# EAGLE design module_special_reg (EAGLE 6.5.0)

## Sheet 1 of 9
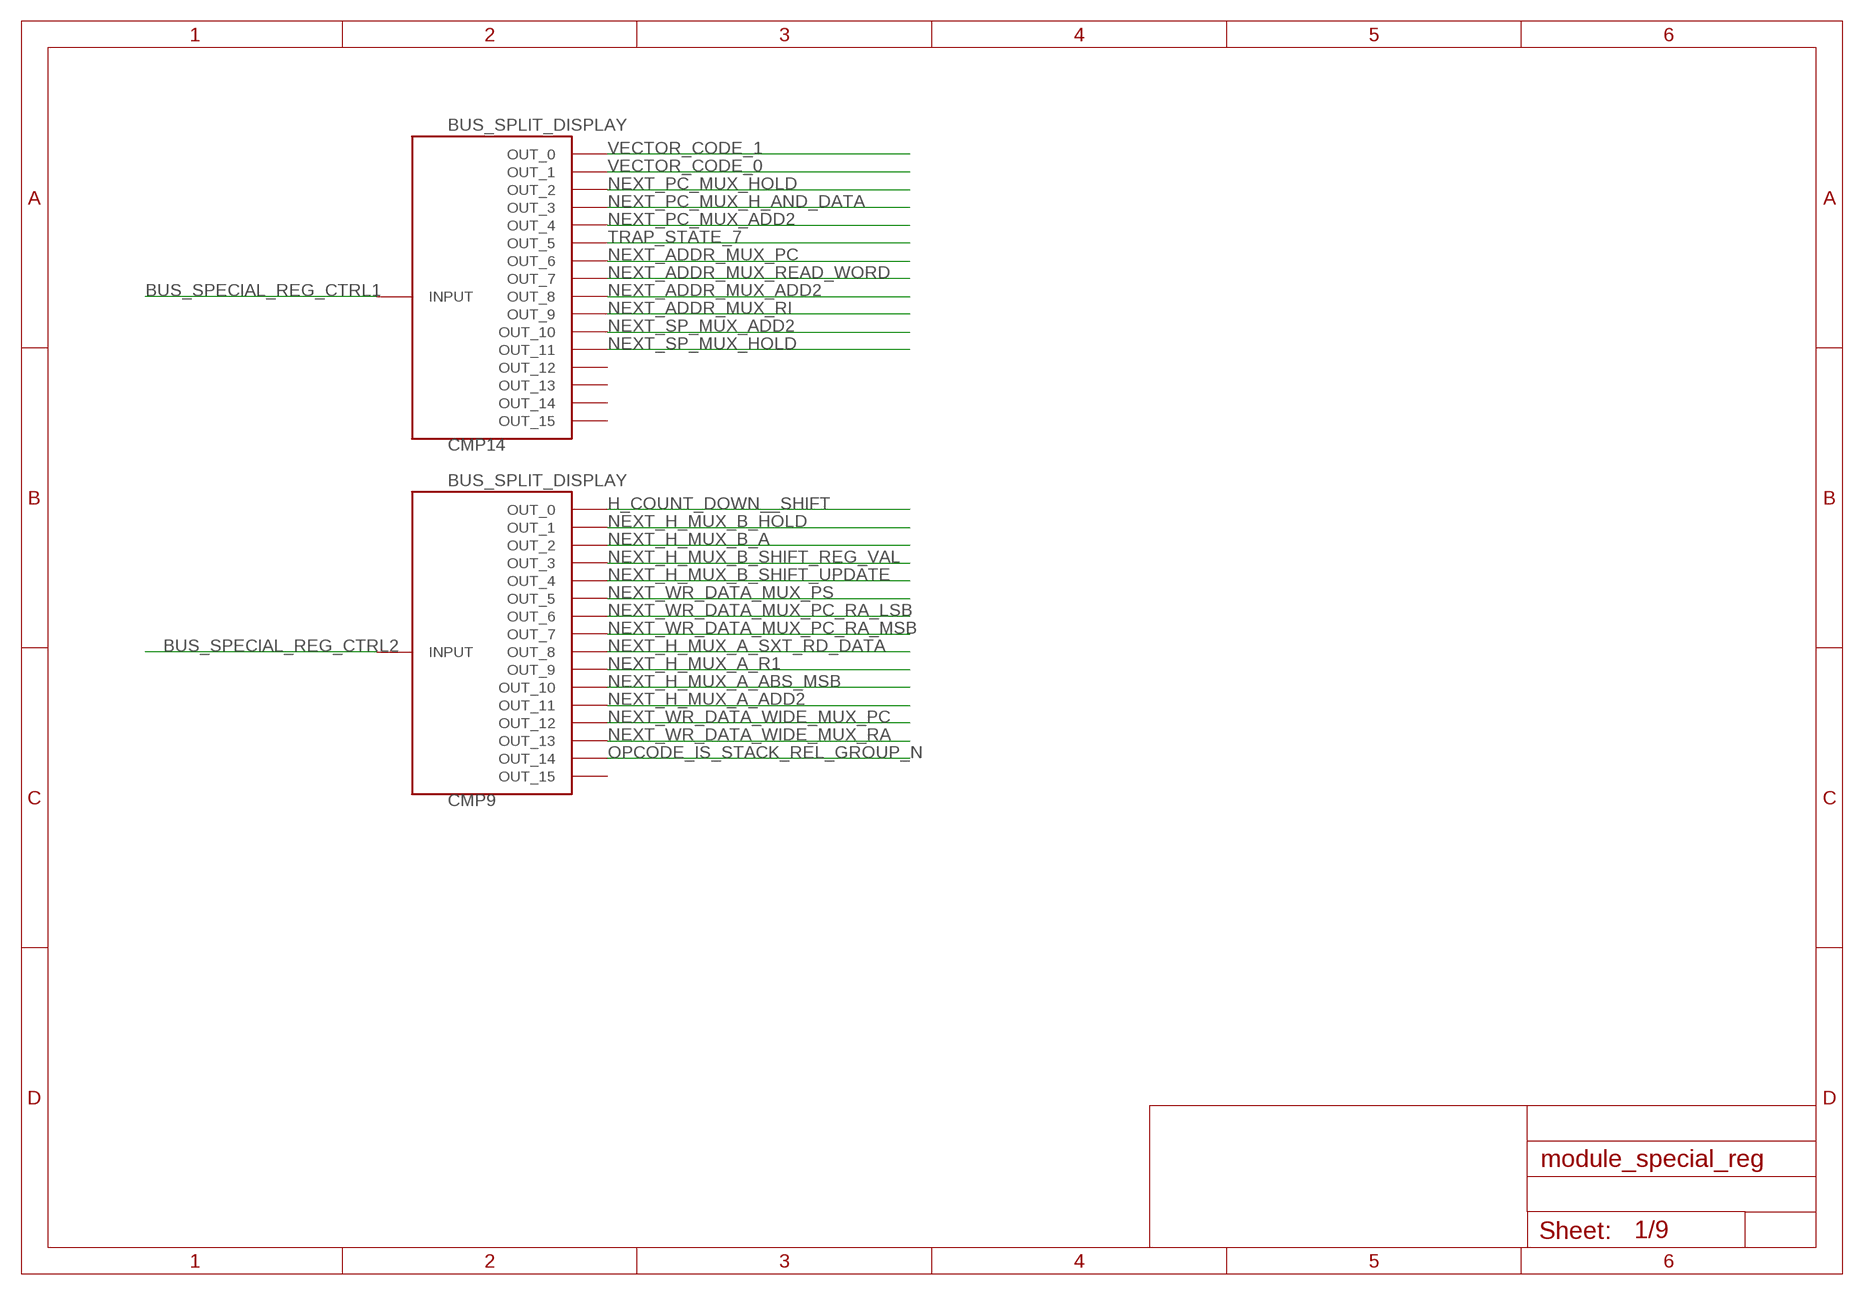
[diagram p0: schematic, sheet 1]

### Parts
CMP9  BUS_SPLIT_DISPLAY  [BUS_SPLIT_DISPLAY]
CMP14  BUS_SPLIT_DISPLAY  [BUS_SPLIT_DISPLAY]

### Nets
BUS_SPECIAL_REG_CTRL1: CMP14.INPUT
BUS_SPECIAL_REG_CTRL2: CMP9.INPUT
H_COUNT_DOWN__SHIFT: CMP9.P$1(OUT_0) ; also sheet 5
NEXT_ADDR_MUX_ADD2: CMP14.P$9(OUT_8) ; also sheet 9
NEXT_ADDR_MUX_PC: CMP14.P$7(OUT_6) ; also sheet 9
NEXT_ADDR_MUX_READ_WORD: CMP14.P$8(OUT_7) ; also sheet 9
NEXT_ADDR_MUX_RI: CMP14.P$10(OUT_9) ; also sheet 9
NEXT_H_MUX_A_ABS_MSB: CMP9.P$11(OUT_10) ; also sheet 4
NEXT_H_MUX_A_ADD2: CMP9.P$12(OUT_11) ; also sheet 4
NEXT_H_MUX_A_R1: CMP9.P$10(OUT_9) ; also sheet 4
NEXT_H_MUX_A_SXT_RD_DATA: CMP9.P$9(OUT_8) ; also sheet 4
NEXT_H_MUX_B_A: CMP9.P$3(OUT_2) ; also sheet 4
NEXT_H_MUX_B_HOLD: CMP9.P$2(OUT_1) ; also sheet 4
NEXT_H_MUX_B_SHIFT_REG_VAL: CMP9.P$4(OUT_3) ; also sheet 4
NEXT_H_MUX_B_SHIFT_UPDATE: CMP9.P$5(OUT_4) ; also sheet 4
NEXT_PC_MUX_ADD2: CMP14.P$5(OUT_4) ; also sheet 8
NEXT_PC_MUX_H_AND_DATA: CMP14.P$4(OUT_3) ; also sheet 8
NEXT_PC_MUX_HOLD: CMP14.P$3(OUT_2) ; also sheet 8
NEXT_SP_MUX_ADD2: CMP14.P$11(OUT_10) ; also sheet 9
NEXT_SP_MUX_HOLD: CMP14.P$12(OUT_11) ; also sheet 9
NEXT_WR_DATA_MUX_PC_RA_LSB: CMP9.P$7(OUT_6) ; also sheet 7
NEXT_WR_DATA_MUX_PC_RA_MSB: CMP9.P$8(OUT_7) ; also sheet 7
NEXT_WR_DATA_MUX_PS: CMP9.P$6(OUT_5) ; also sheet 7
NEXT_WR_DATA_WIDE_MUX_PC: CMP9.P$13(OUT_12) ; also sheet 7
NEXT_WR_DATA_WIDE_MUX_RA: CMP9.P$14(OUT_13) ; also sheet 7
OPCODE_IS_STACK_REL_GROUP_N: CMP9.P$15(OUT_14) ; also sheet 6
TRAP_STATE_7: CMP14.P$6(OUT_5) ; also sheet 8
VECTOR_CODE_0: CMP14.P$2(OUT_1) ; also sheet 8
VECTOR_CODE_1: CMP14.P$1(OUT_0) ; also sheet 8
Unconnected: CMP9.P$16(OUT_15) CMP14.P$13(OUT_12) CMP14.P$14(OUT_13) CMP14.P$15(OUT_14) CMP14.P$16(OUT_15)

## Sheet 2 of 9
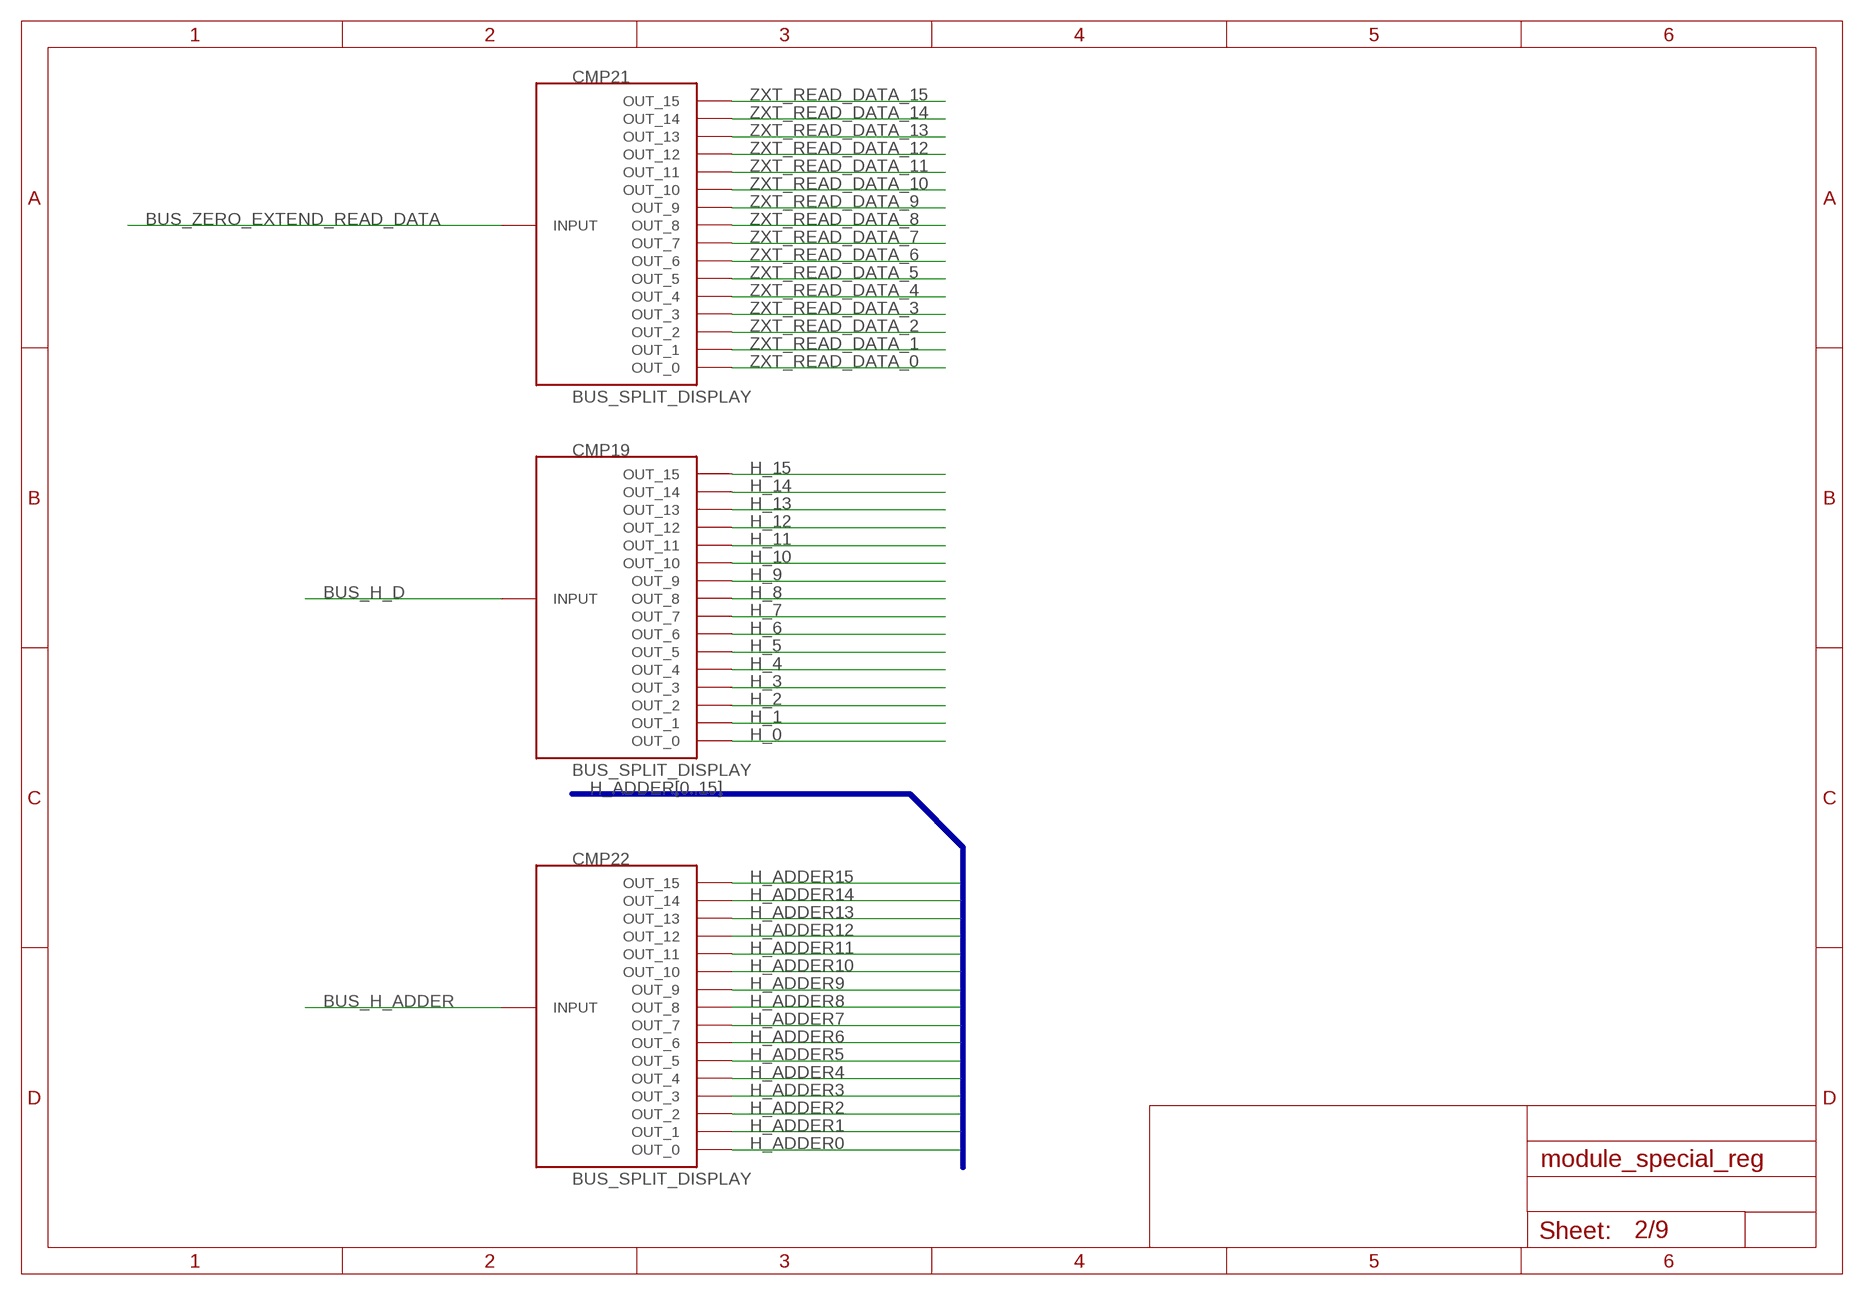
[diagram p1: schematic, sheet 2]

### Parts
CMP19  BUS_SPLIT_DISPLAY  [BUS_SPLIT_DISPLAY]
CMP21  BUS_SPLIT_DISPLAY  [BUS_SPLIT_DISPLAY]
CMP22  BUS_SPLIT_DISPLAY  [BUS_SPLIT_DISPLAY]

### Nets
BUS_H_ADDER: CMP22.INPUT ; also sheet 5
BUS_H_D: CMP19.INPUT ; also sheet 4
BUS_ZERO_EXTEND_READ_DATA: CMP21.INPUT
H_0: CMP19.P$1(OUT_0)
H_1: CMP19.P$2(OUT_1)
H_2: CMP19.P$3(OUT_2)
H_3: CMP19.P$4(OUT_3)
H_4: CMP19.P$5(OUT_4)
H_5: CMP19.P$6(OUT_5) ; also sheet 6
H_6: CMP19.P$7(OUT_6) ; also sheet 6
H_7: CMP19.P$8(OUT_7) ; also sheet 6
H_8: CMP19.P$9(OUT_8)
H_9: CMP19.P$10(OUT_9)
H_10: CMP19.P$11(OUT_10)
H_11: CMP19.P$12(OUT_11)
H_12: CMP19.P$13(OUT_12)
H_13: CMP19.P$14(OUT_13)
H_14: CMP19.P$15(OUT_14)
H_15: CMP19.P$16(OUT_15)
H_ADDER0: CMP22.P$1(OUT_0) ; also sheet 6
H_ADDER1: CMP22.P$2(OUT_1) ; also sheet 6
H_ADDER2: CMP22.P$3(OUT_2) ; also sheet 6
H_ADDER3: CMP22.P$4(OUT_3) ; also sheet 6
H_ADDER4: CMP22.P$5(OUT_4) ; also sheet 6
H_ADDER5: CMP22.P$6(OUT_5)
H_ADDER6: CMP22.P$7(OUT_6)
H_ADDER7: CMP22.P$8(OUT_7)
H_ADDER8: CMP22.P$9(OUT_8)
H_ADDER9: CMP22.P$10(OUT_9)
H_ADDER10: CMP22.P$11(OUT_10)
H_ADDER11: CMP22.P$12(OUT_11)
H_ADDER12: CMP22.P$13(OUT_12)
H_ADDER13: CMP22.P$14(OUT_13)
H_ADDER14: CMP22.P$15(OUT_14)
H_ADDER15: CMP22.P$16(OUT_15)
ZXT_READ_DATA_0: CMP21.P$1(OUT_0) ; also sheet 6
ZXT_READ_DATA_1: CMP21.P$2(OUT_1) ; also sheet 6
ZXT_READ_DATA_2: CMP21.P$3(OUT_2) ; also sheet 6
ZXT_READ_DATA_3: CMP21.P$4(OUT_3) ; also sheet 6
ZXT_READ_DATA_4: CMP21.P$5(OUT_4) ; also sheet 6
ZXT_READ_DATA_5: CMP21.P$6(OUT_5) ; also sheet 6
ZXT_READ_DATA_6: CMP21.P$7(OUT_6) ; also sheet 6
ZXT_READ_DATA_7: CMP21.P$8(OUT_7) ; also sheet 6
ZXT_READ_DATA_8: CMP21.P$9(OUT_8)
ZXT_READ_DATA_9: CMP21.P$10(OUT_9)
ZXT_READ_DATA_10: CMP21.P$11(OUT_10)
ZXT_READ_DATA_11: CMP21.P$12(OUT_11)
ZXT_READ_DATA_12: CMP21.P$13(OUT_12)
ZXT_READ_DATA_13: CMP21.P$14(OUT_13)
ZXT_READ_DATA_14: CMP21.P$15(OUT_14)
ZXT_READ_DATA_15: CMP21.P$16(OUT_15)

### Buses
H_ADDER[0..15]

## Sheet 3 of 9
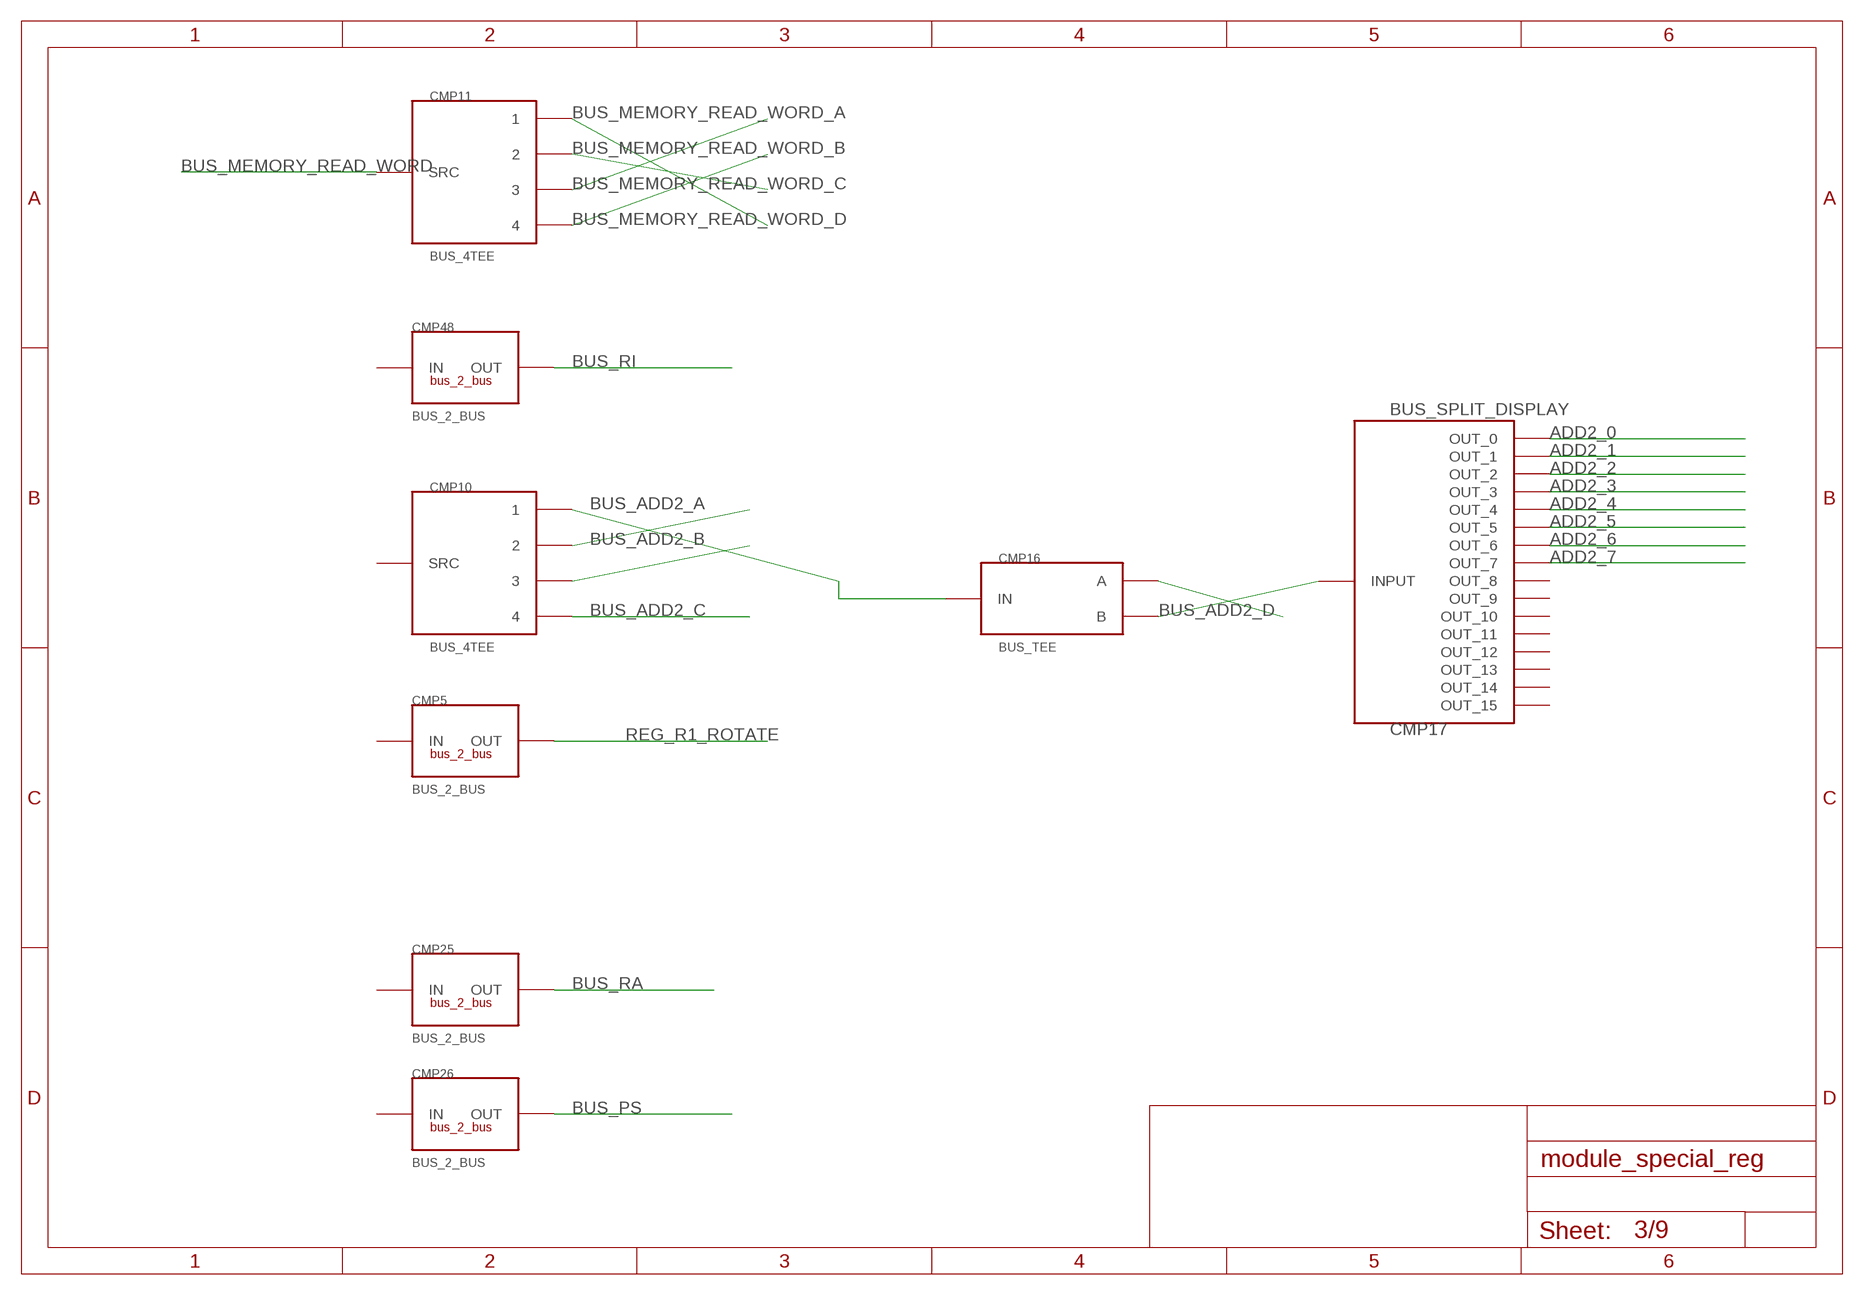
[diagram p2: schematic, sheet 3]

### Parts
CMP5  BUS_2_BUS  [BUS2BUS]
CMP10  BUS_4TEE  [BUS_4TEE]
CMP11  BUS_4TEE  [BUS_4TEE]
CMP16  BUS_TEE  [BUS_TEE]
CMP17  BUS_SPLIT_DISPLAY  [BUS_SPLIT_DISPLAY]
CMP25  BUS_2_BUS  [BUS2BUS]
CMP26  BUS_2_BUS  [BUS2BUS]
CMP48  BUS_2_BUS  [BUS2BUS]

### Nets
ADD2_0: CMP17.P$1(OUT_0) ; also sheet 6
ADD2_1: CMP17.P$2(OUT_1) ; also sheet 6
ADD2_2: CMP17.P$3(OUT_2) ; also sheet 6
ADD2_3: CMP17.P$4(OUT_3) ; also sheet 6
ADD2_4: CMP17.P$5(OUT_4) ; also sheet 6
ADD2_5: CMP17.P$6(OUT_5) ; also sheet 6
ADD2_6: CMP17.P$7(OUT_6) ; also sheet 6
ADD2_7: CMP17.P$8(OUT_7) ; also sheet 6
BUS_ADD2_A: CMP10.2 ; also sheet 8
BUS_ADD2_B: CMP10.3 ; also sheet 9
BUS_ADD2_C: CMP10.4 ; also sheet 9
BUS_ADD2_D: CMP16.OUT_A(A) ; also sheet 4
BUS_MEMORY_READ_WORD: CMP11.SRC
BUS_MEMORY_READ_WORD_A: CMP11.3 ; also sheet 9
BUS_MEMORY_READ_WORD_B: CMP11.4 ; also sheet 8
BUS_MEMORY_READ_WORD_C: CMP11.2 ; also sheet 4
BUS_MEMORY_READ_WORD_D: CMP11.1
BUS_PS: CMP26.P$2(OUT) ; also sheet 7
BUS_RA: CMP25.P$2(OUT) ; also sheet 7
BUS_RI: CMP48.P$2(OUT) ; also sheet 9
N$9: CMP16.OUTB(B) CMP17.INPUT
N$10: CMP10.1 CMP16.INPUT(IN)
REG_R1_ROTATE: CMP5.P$2(OUT) ; also sheet 4
Unconnected: CMP5.P$1(IN) CMP10.SRC CMP17.P$9(OUT_8) CMP17.P$10(OUT_9) CMP17.P$11(OUT_10) CMP17.P$12(OUT_11) CMP17.P$13(OUT_12) CMP17.P$14(OUT_13) CMP17.P$15(OUT_14) CMP17.P$16(OUT_15) CMP25.P$1(IN) CMP26.P$1(IN) CMP48.P$1(IN)

## Sheet 4 of 9
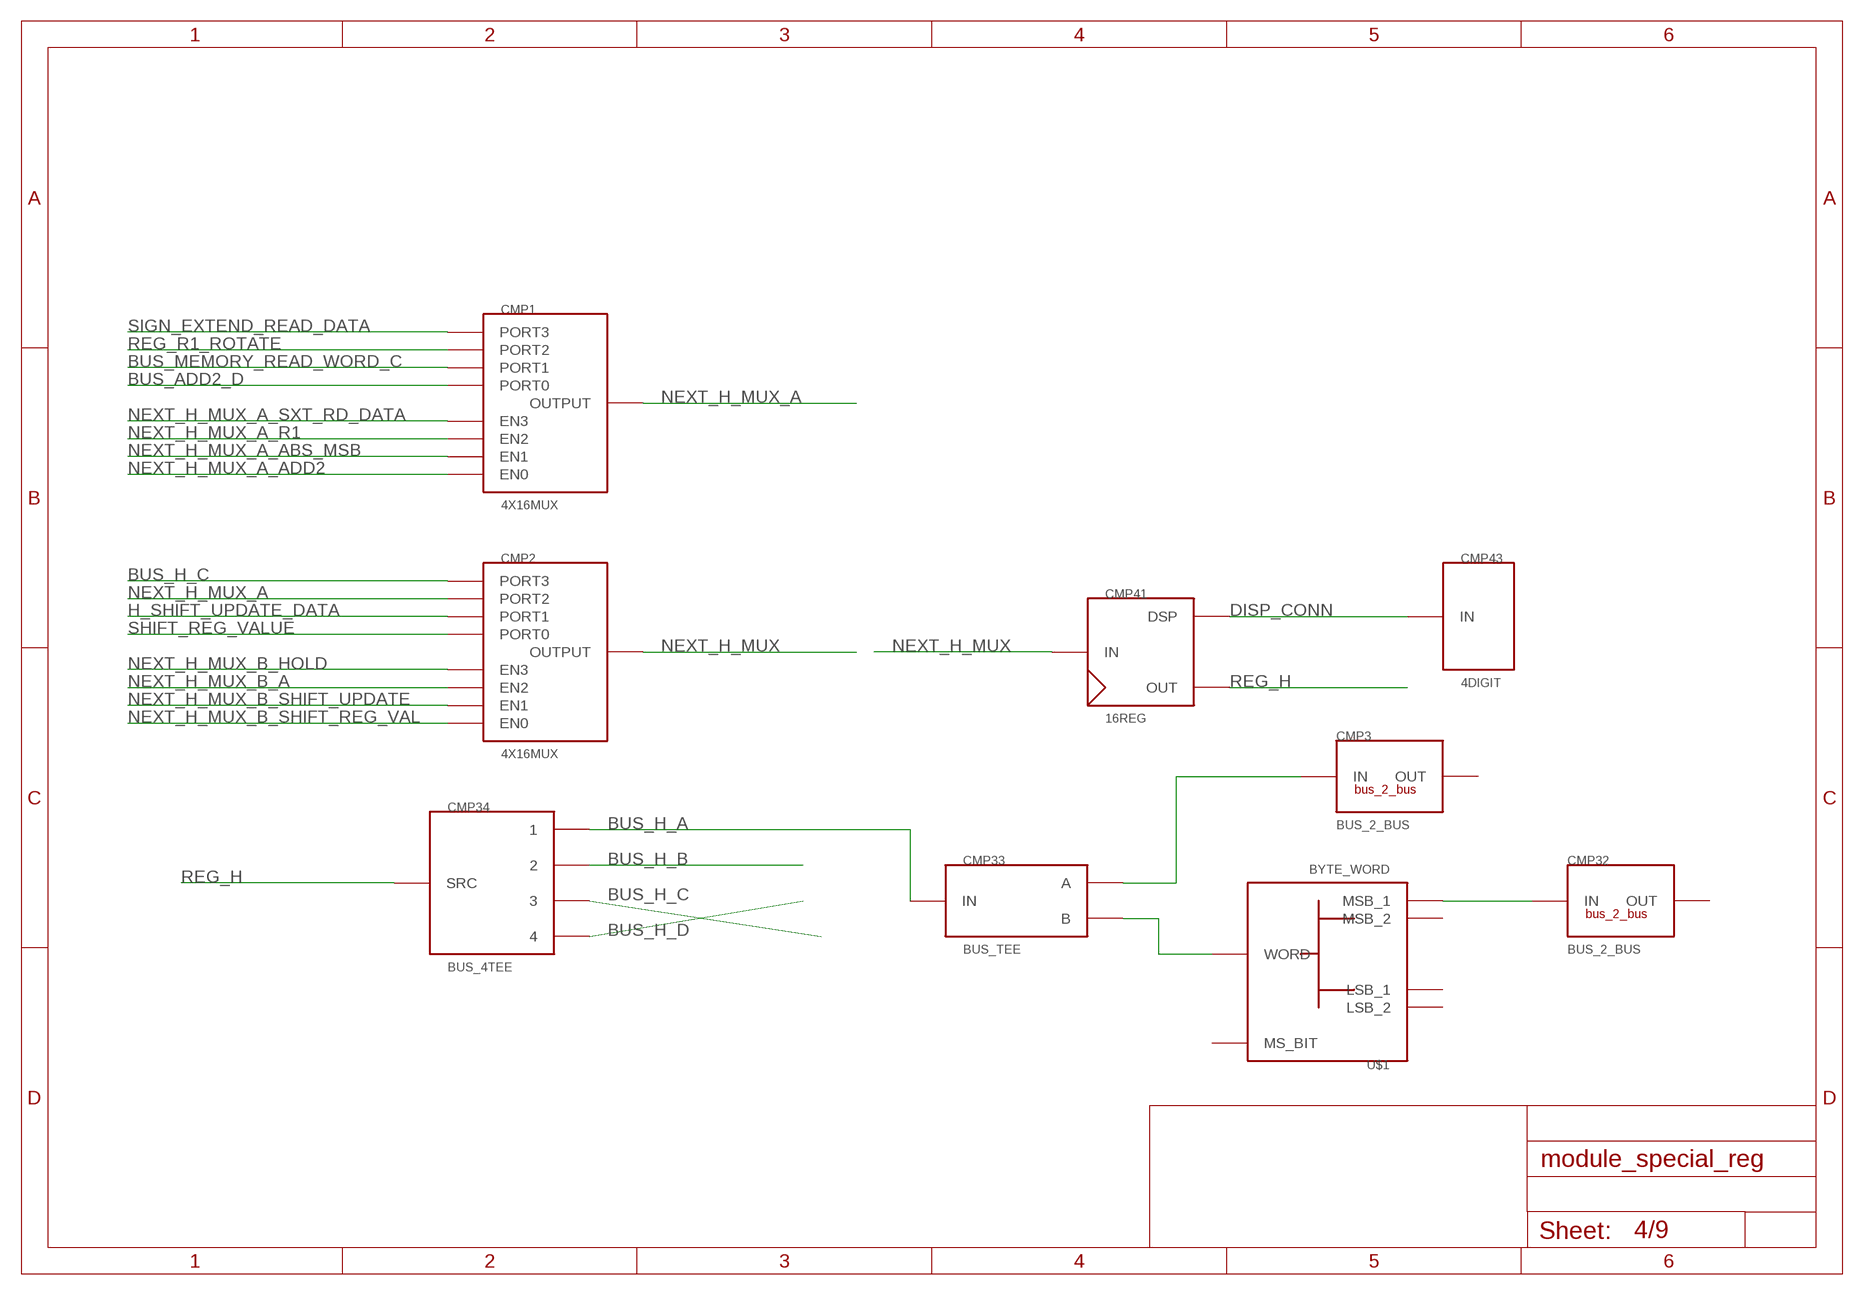
[diagram p3: schematic, sheet 4]

### Parts
CMP1  4X16MUX  [4X16MUX]
CMP2  4X16MUX  [4X16MUX]
CMP3  BUS_2_BUS  [BUS2BUS]
CMP32  BUS_2_BUS  [BUS2BUS]
CMP33  BUS_TEE  [BUS_TEE]
CMP34  BUS_4TEE  [BUS_4TEE]
CMP41  16REG  [16REG]
CMP43  4DIGIT  [4DIGIT]
U$1  BYTE_WORD  [WORD_BYTE]

### Nets
BUS_ADD2_D: CMP1.PORT0 ; also sheet 3
BUS_H_A: CMP33.INPUT(IN) CMP34.1
BUS_H_B: CMP34.2 ; also sheet 5
BUS_H_C: CMP2.PORT3 CMP34.4
BUS_H_D: CMP34.3 ; also sheet 2
BUS_MEMORY_READ_WORD_C: CMP1.PORT1 ; also sheet 3
DISP_CONN: CMP41.DISPLAY(DSP) CMP43.P$1(IN)
H_MSB: CMP32.P$1(IN) U$1.MSB_1
H_OUT: CMP3.P$1(IN) CMP33.OUT_A(A)
H_SHIFT_UPDATE_DATA: CMP2.PORT1 ; also sheet 6
N$19: CMP33.OUTB(B) U$1.SRC(WORD)
NEXT_H_MUX: CMP2.PORTOUT(OUTPUT) CMP41.INPUT(IN)
NEXT_H_MUX_A: CMP1.PORTOUT(OUTPUT) CMP2.PORT2
NEXT_H_MUX_A_ABS_MSB: CMP1.EN1 ; also sheet 1
NEXT_H_MUX_A_ADD2: CMP1.EN0 ; also sheet 1
NEXT_H_MUX_A_R1: CMP1.EN2 ; also sheet 1
NEXT_H_MUX_A_SXT_RD_DATA: CMP1.EN3 ; also sheet 1
NEXT_H_MUX_B_A: CMP2.EN2 ; also sheet 1
NEXT_H_MUX_B_HOLD: CMP2.EN3 ; also sheet 1
NEXT_H_MUX_B_SHIFT_REG_VAL: CMP2.EN0 ; also sheet 1
NEXT_H_MUX_B_SHIFT_UPDATE: CMP2.EN1 ; also sheet 1
REG_H: CMP34.SRC CMP41.OUT
REG_R1_ROTATE: CMP1.PORT2 ; also sheet 3
SHIFT_REG_VALUE: CMP2.PORT0 ; also sheet 6
SIGN_EXTEND_READ_DATA: CMP1.PORT3 ; also sheet 6
Unconnected: CMP3.P$2(OUT) CMP32.P$2(OUT) U$1.LSB_1 U$1.LSB_2 U$1.MS_BIT U$1.MSB_2

## Sheet 5 of 9
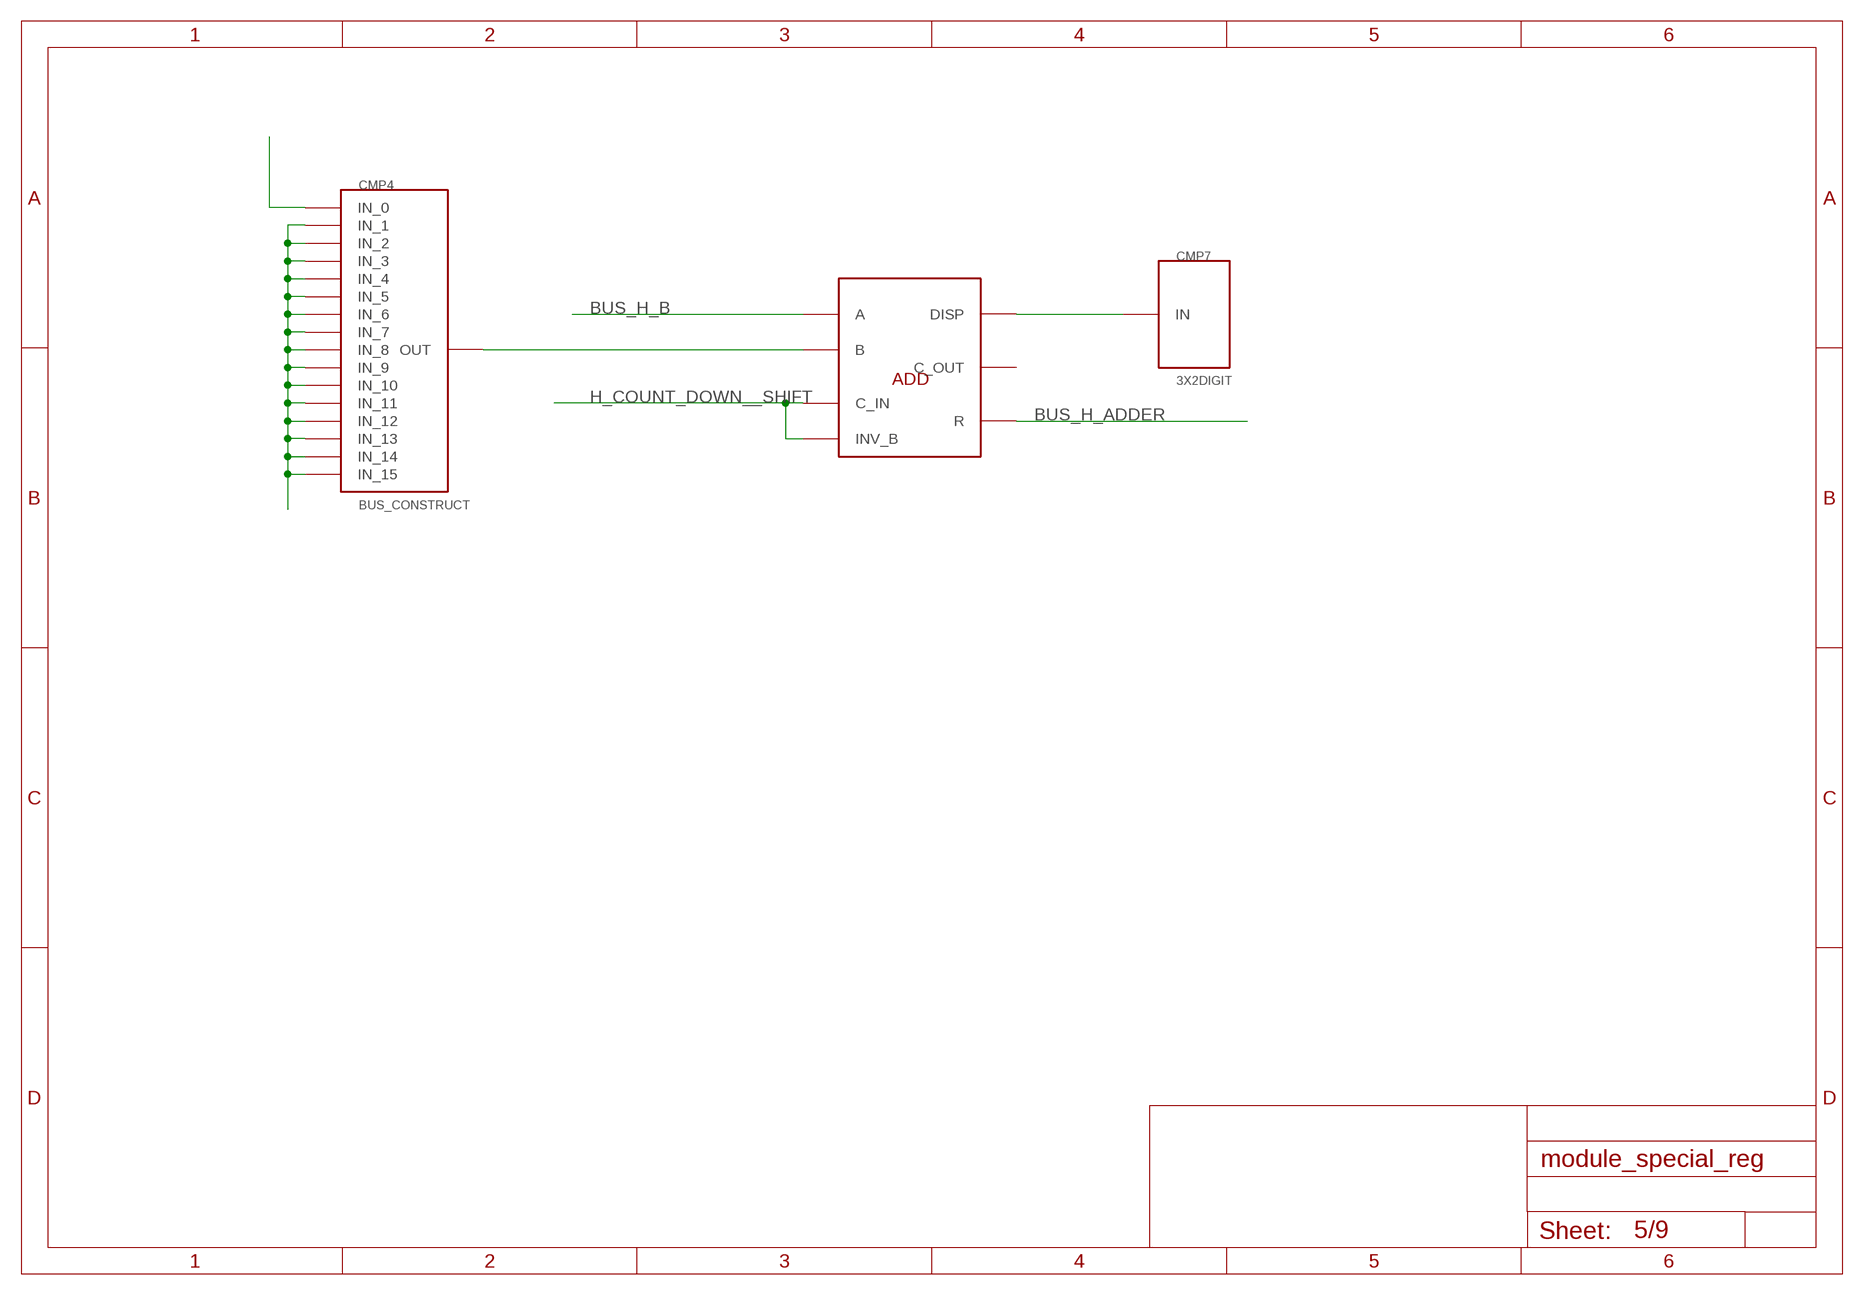
[diagram p4: schematic, sheet 5]

### Parts
CMP4  BUS_CONSTRUCT  [BUS_SPLIT]
CMP6  8BIT_ADD_SUB  [8BIT_ADD_SUB]
CMP7  3X2DIGIT  [3X2DIGIT]

### Nets
BUS_H_ADDER: CMP6.R ; also sheet 2
BUS_H_B: CMP6.A ; also sheet 4
H_COUNT_DOWN__SHIFT: CMP6.C_IN CMP6.INV_B ; also sheet 1
N$1: CMP4.INPUT(OUT) CMP6.B
N$4: CMP4.P$1(IN_0)
N$5: CMP4.P$2(IN_1) CMP4.P$3(IN_2) CMP4.P$4(IN_3) CMP4.P$5(IN_4) CMP4.P$6(IN_5) CMP4.P$7(IN_6) CMP4.P$8(IN_7) CMP4.P$9(IN_8) CMP4.P$10(IN_9) CMP4.P$11(IN_10) CMP4.P$12(IN_11) CMP4.P$13(IN_12) CMP4.P$14(IN_13) CMP4.P$15(IN_14) CMP4.P$16(IN_15)
N$6: CMP6.DISP CMP7.P$1(IN)
Unconnected: CMP6.C_OUT

## Sheet 6 of 9
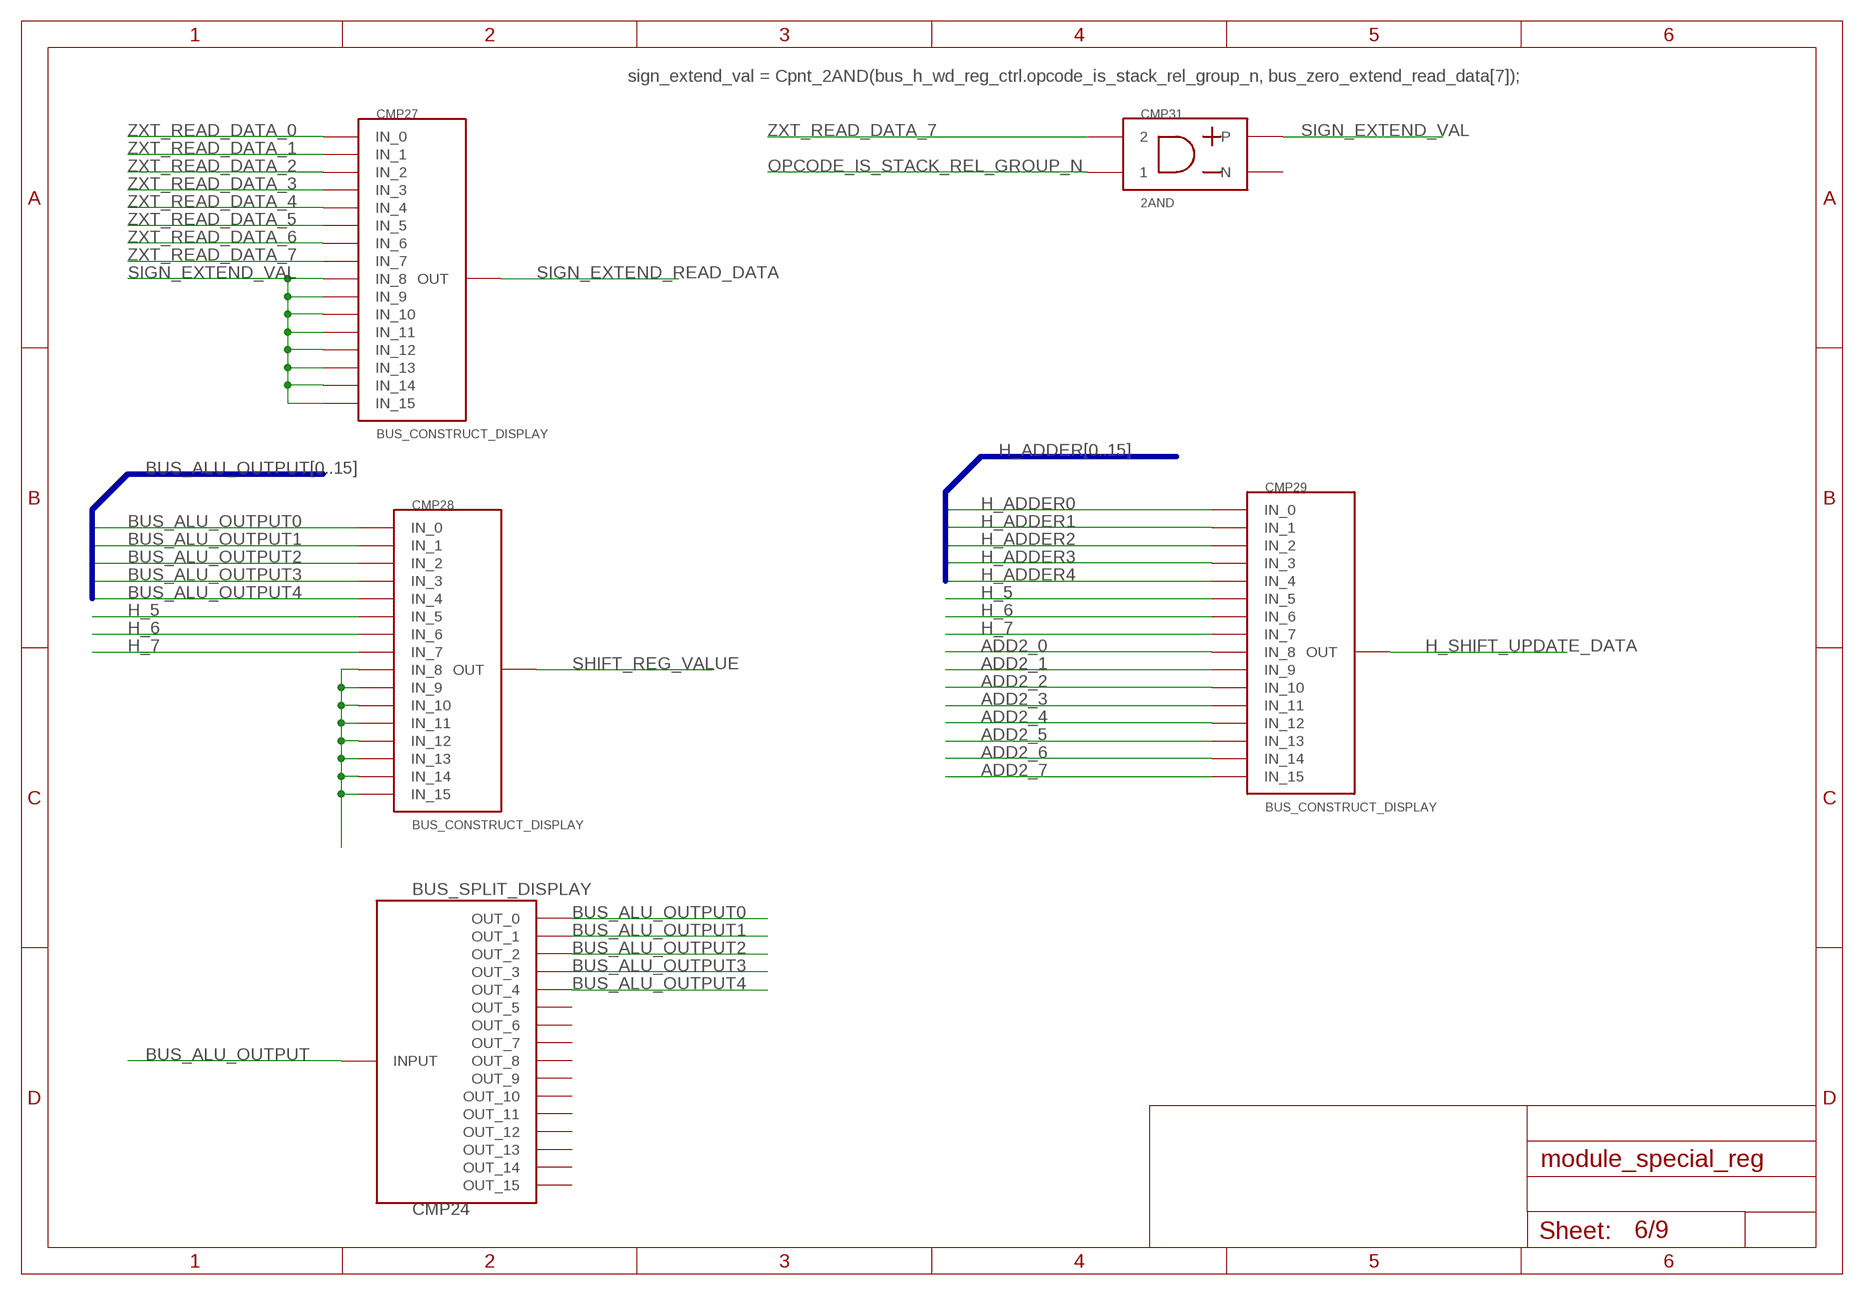
[diagram p5: schematic, sheet 6]

### Parts
CMP24  BUS_SPLIT_DISPLAY  [BUS_SPLIT_DISPLAY]
CMP27  BUS_CONSTRUCT_DISPLAY  [BUS_SPLIT_DISPLAY]
CMP28  BUS_CONSTRUCT_DISPLAY  [BUS_SPLIT_DISPLAY]
CMP29  BUS_CONSTRUCT_DISPLAY  [BUS_SPLIT_DISPLAY]
CMP31  2AND  [2AND]

### Nets
ADD2_0: CMP29.P$9(IN_8) ; also sheet 3
ADD2_1: CMP29.P$10(IN_9) ; also sheet 3
ADD2_2: CMP29.P$11(IN_10) ; also sheet 3
ADD2_3: CMP29.P$12(IN_11) ; also sheet 3
ADD2_4: CMP29.P$13(IN_12) ; also sheet 3
ADD2_5: CMP29.P$14(IN_13) ; also sheet 3
ADD2_6: CMP29.P$15(IN_14) ; also sheet 3
ADD2_7: CMP29.P$16(IN_15) ; also sheet 3
BUS_ALU_OUTPUT: CMP24.INPUT
BUS_ALU_OUTPUT0: CMP24.P$1(OUT_0) CMP28.P$1(IN_0)
BUS_ALU_OUTPUT1: CMP24.P$2(OUT_1) CMP28.P$2(IN_1)
BUS_ALU_OUTPUT2: CMP24.P$3(OUT_2) CMP28.P$3(IN_2)
BUS_ALU_OUTPUT3: CMP24.P$4(OUT_3) CMP28.P$4(IN_3)
BUS_ALU_OUTPUT4: CMP24.P$5(OUT_4) CMP28.P$5(IN_4)
H_5: CMP28.P$6(IN_5) CMP29.P$6(IN_5) ; also sheet 2
H_6: CMP28.P$7(IN_6) CMP29.P$7(IN_6) ; also sheet 2
H_7: CMP28.P$8(IN_7) CMP29.P$8(IN_7) ; also sheet 2
H_ADDER0: CMP29.P$1(IN_0) ; also sheet 2
H_ADDER1: CMP29.P$2(IN_1) ; also sheet 2
H_ADDER2: CMP29.P$3(IN_2) ; also sheet 2
H_ADDER3: CMP29.P$4(IN_3) ; also sheet 2
H_ADDER4: CMP29.P$5(IN_4) ; also sheet 2
H_SHIFT_UPDATE_DATA: CMP29.INPUT(OUT) ; also sheet 4
N$8: CMP28.P$9(IN_8) CMP28.P$10(IN_9) CMP28.P$11(IN_10) CMP28.P$12(IN_11) CMP28.P$13(IN_12) CMP28.P$14(IN_13) CMP28.P$15(IN_14) CMP28.P$16(IN_15)
OPCODE_IS_STACK_REL_GROUP_N: CMP31.P$1 ; also sheet 1
SHIFT_REG_VALUE: CMP28.INPUT(OUT) ; also sheet 4
SIGN_EXTEND_READ_DATA: CMP27.INPUT(OUT) ; also sheet 4
SIGN_EXTEND_VAL: CMP27.P$9(IN_8) CMP27.P$10(IN_9) CMP27.P$11(IN_10) CMP27.P$12(IN_11) CMP27.P$13(IN_12) CMP27.P$14(IN_13) CMP27.P$15(IN_14) CMP27.P$16(IN_15) CMP31.OUT_P(P)
ZXT_READ_DATA_0: CMP27.P$1(IN_0) ; also sheet 2
ZXT_READ_DATA_1: CMP27.P$2(IN_1) ; also sheet 2
ZXT_READ_DATA_2: CMP27.P$3(IN_2) ; also sheet 2
ZXT_READ_DATA_3: CMP27.P$4(IN_3) ; also sheet 2
ZXT_READ_DATA_4: CMP27.P$5(IN_4) ; also sheet 2
ZXT_READ_DATA_5: CMP27.P$6(IN_5) ; also sheet 2
ZXT_READ_DATA_6: CMP27.P$7(IN_6) ; also sheet 2
ZXT_READ_DATA_7: CMP27.P$8(IN_7) CMP31.P$2 ; also sheet 2
Unconnected: CMP24.P$6(OUT_5) CMP24.P$7(OUT_6) CMP24.P$8(OUT_7) CMP24.P$9(OUT_8) CMP24.P$10(OUT_9) CMP24.P$11(OUT_10) CMP24.P$12(OUT_11) CMP24.P$13(OUT_12) CMP24.P$14(OUT_13) CMP24.P$15(OUT_14) CMP24.P$16(OUT_15) CMP31.OUT_M(N)

### Buses
BUS_ALU_OUTPUT[0..15]
H_ADDER[0..15]

### Notes on the sheet
- sign_extend_val = Cpnt_2AND(bus_h_wd_reg_ctrl.opcode_is_stack_rel_group_n, bus_zero_extend_read_data[7]);

## Sheet 7 of 9
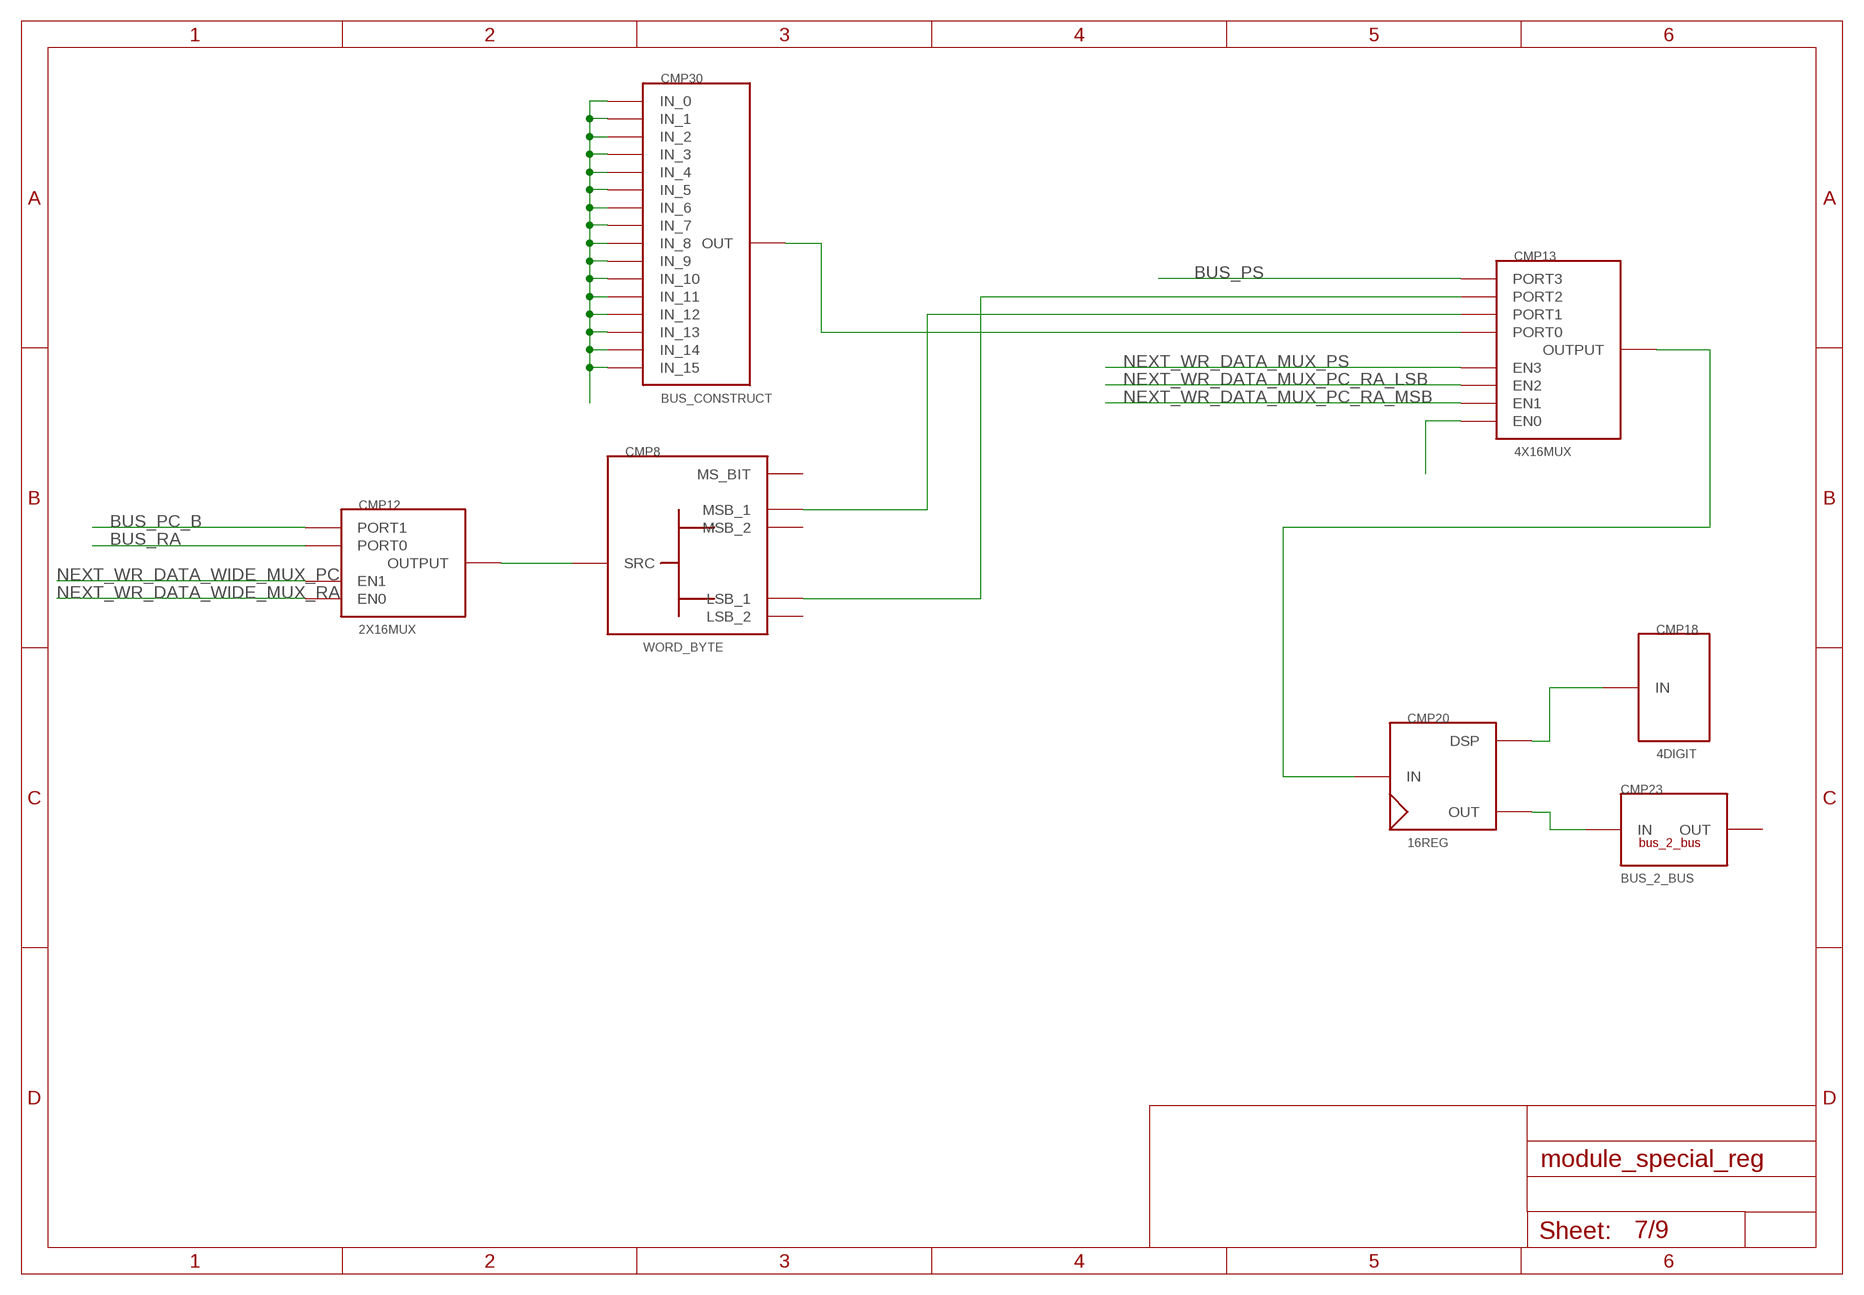
[diagram p6: schematic, sheet 7]

### Parts
CMP8  WORD_BYTE  [WORD_BYTE]
CMP12  2X16MUX  [2X16MUX]
CMP13  4X16MUX  [4X16MUX]
CMP18  4DIGIT  [4DIGIT]
CMP20  16REG  [16REG]
CMP23  BUS_2_BUS  [BUS2BUS]
CMP30  BUS_CONSTRUCT  [BUS_SPLIT]

### Nets
BUS_PC_B: CMP12.PORT1 ; also sheet 8
BUS_PS: CMP13.PORT3 ; also sheet 3
BUS_RA: CMP12.PORT0 ; also sheet 3
N$2: CMP8.SRC CMP12.OUT(OUTPUT)
N$3: CMP8.MSB_1 CMP13.PORT1
N$7: CMP8.LSB_1 CMP13.PORT2
N$11: CMP13.EN0
N$15: CMP13.PORT0 CMP30.INPUT(OUT)
N$16: CMP30.P$1(IN_0) CMP30.P$2(IN_1) CMP30.P$3(IN_2) CMP30.P$4(IN_3) CMP30.P$5(IN_4) CMP30.P$6(IN_5) CMP30.P$7(IN_6) CMP30.P$8(IN_7) CMP30.P$9(IN_8) CMP30.P$10(IN_9) CMP30.P$11(IN_10) CMP30.P$12(IN_11) CMP30.P$13(IN_12) CMP30.P$14(IN_13) CMP30.P$15(IN_14) CMP30.P$16(IN_15)
N$33: CMP13.PORTOUT(OUTPUT) CMP20.INPUT(IN)
N$34: CMP18.P$1(IN) CMP20.DISPLAY(DSP)
N$35: CMP20.OUT CMP23.P$1(IN)
NEXT_WR_DATA_MUX_PC_RA_LSB: CMP13.EN2 ; also sheet 1
NEXT_WR_DATA_MUX_PC_RA_MSB: CMP13.EN1 ; also sheet 1
NEXT_WR_DATA_MUX_PS: CMP13.EN3 ; also sheet 1
NEXT_WR_DATA_WIDE_MUX_PC: CMP12.EN1 ; also sheet 1
NEXT_WR_DATA_WIDE_MUX_RA: CMP12.EN0 ; also sheet 1
Unconnected: CMP8.LSB_2 CMP8.MS_BIT CMP8.MSB_2 CMP23.P$2(OUT)

## Sheet 8 of 9
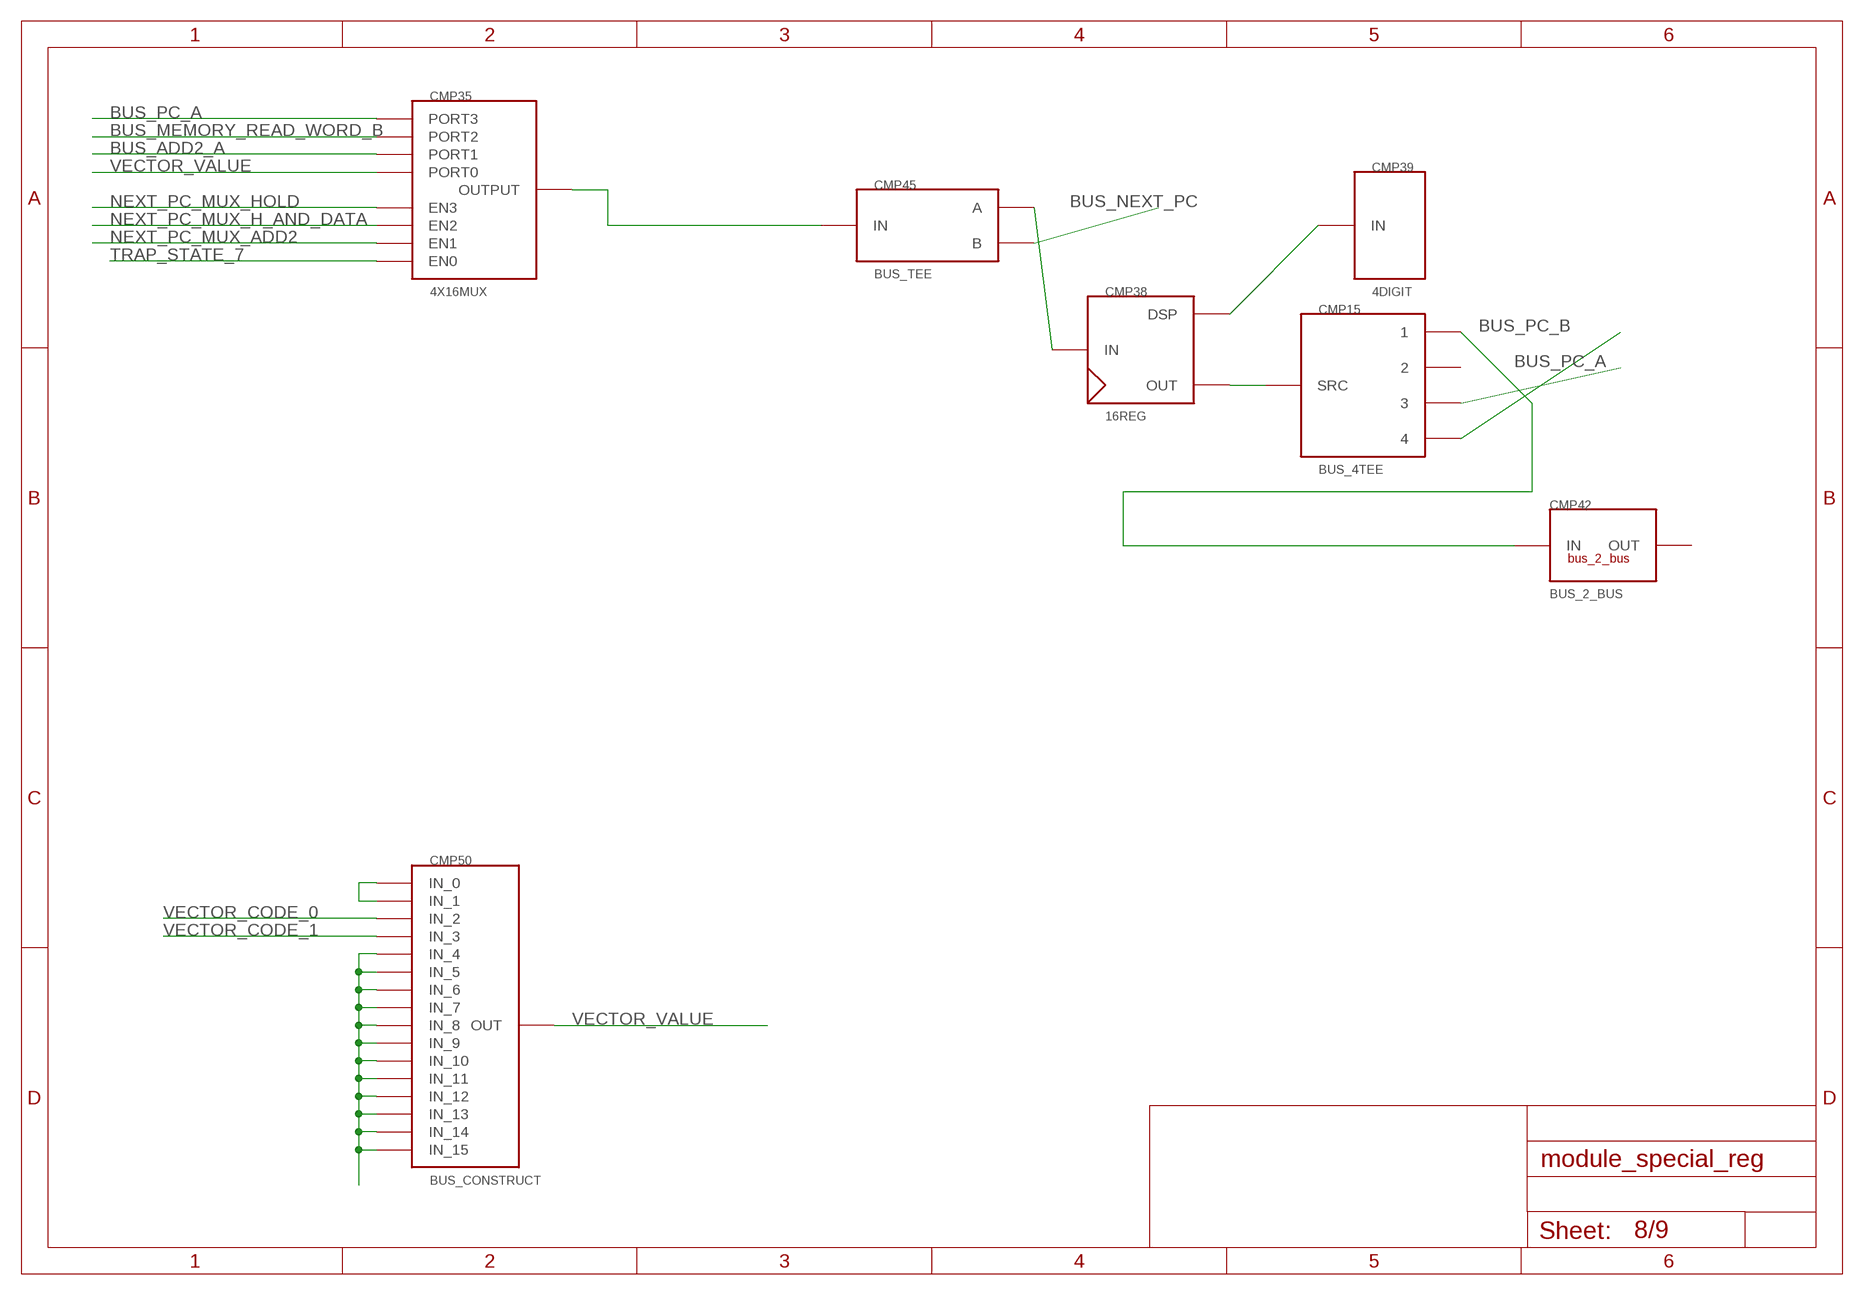
[diagram p7: schematic, sheet 8]

### Parts
CMP15  BUS_4TEE  [BUS_4TEE]
CMP35  4X16MUX  [4X16MUX]
CMP38  16REG  [16REG]
CMP39  4DIGIT  [4DIGIT]
CMP42  BUS_2_BUS  [BUS2BUS]
CMP45  BUS_TEE  [BUS_TEE]
CMP50  BUS_CONSTRUCT  [BUS_SPLIT]

### Nets
BUS_ADD2_A: CMP35.PORT1 ; also sheet 3
BUS_MEMORY_READ_WORD_B: CMP35.PORT2 ; also sheet 3
BUS_NEXT_PC: CMP45.OUTB(B) ; also sheet 9
BUS_PC_A: CMP15.3 CMP35.PORT3
BUS_PC_B: CMP15.4 ; also sheet 7
N$12: CMP50.P$1(IN_0) CMP50.P$2(IN_1)
N$38: CMP35.PORTOUT(OUTPUT) CMP45.INPUT(IN)
N$42: CMP38.DISPLAY(DSP) CMP39.P$1(IN)
N$43: CMP15.SRC CMP38.OUT
N$44: CMP15.1 CMP42.P$1(IN)
N$46: CMP38.INPUT(IN) CMP45.OUT_A(A)
N$48: CMP50.P$5(IN_4) CMP50.P$6(IN_5) CMP50.P$7(IN_6) CMP50.P$8(IN_7) CMP50.P$9(IN_8) CMP50.P$10(IN_9) CMP50.P$11(IN_10) CMP50.P$12(IN_11) CMP50.P$13(IN_12) CMP50.P$14(IN_13) CMP50.P$15(IN_14) CMP50.P$16(IN_15)
NEXT_PC_MUX_ADD2: CMP35.EN1 ; also sheet 1
NEXT_PC_MUX_H_AND_DATA: CMP35.EN2 ; also sheet 1
NEXT_PC_MUX_HOLD: CMP35.EN3 ; also sheet 1
TRAP_STATE_7: CMP35.EN0 ; also sheet 1
VECTOR_CODE_0: CMP50.P$3(IN_2) ; also sheet 1
VECTOR_CODE_1: CMP50.P$4(IN_3) ; also sheet 1
VECTOR_VALUE: CMP35.PORT0 CMP50.INPUT(OUT)
Unconnected: CMP15.2 CMP42.P$2(OUT)

## Sheet 9 of 9
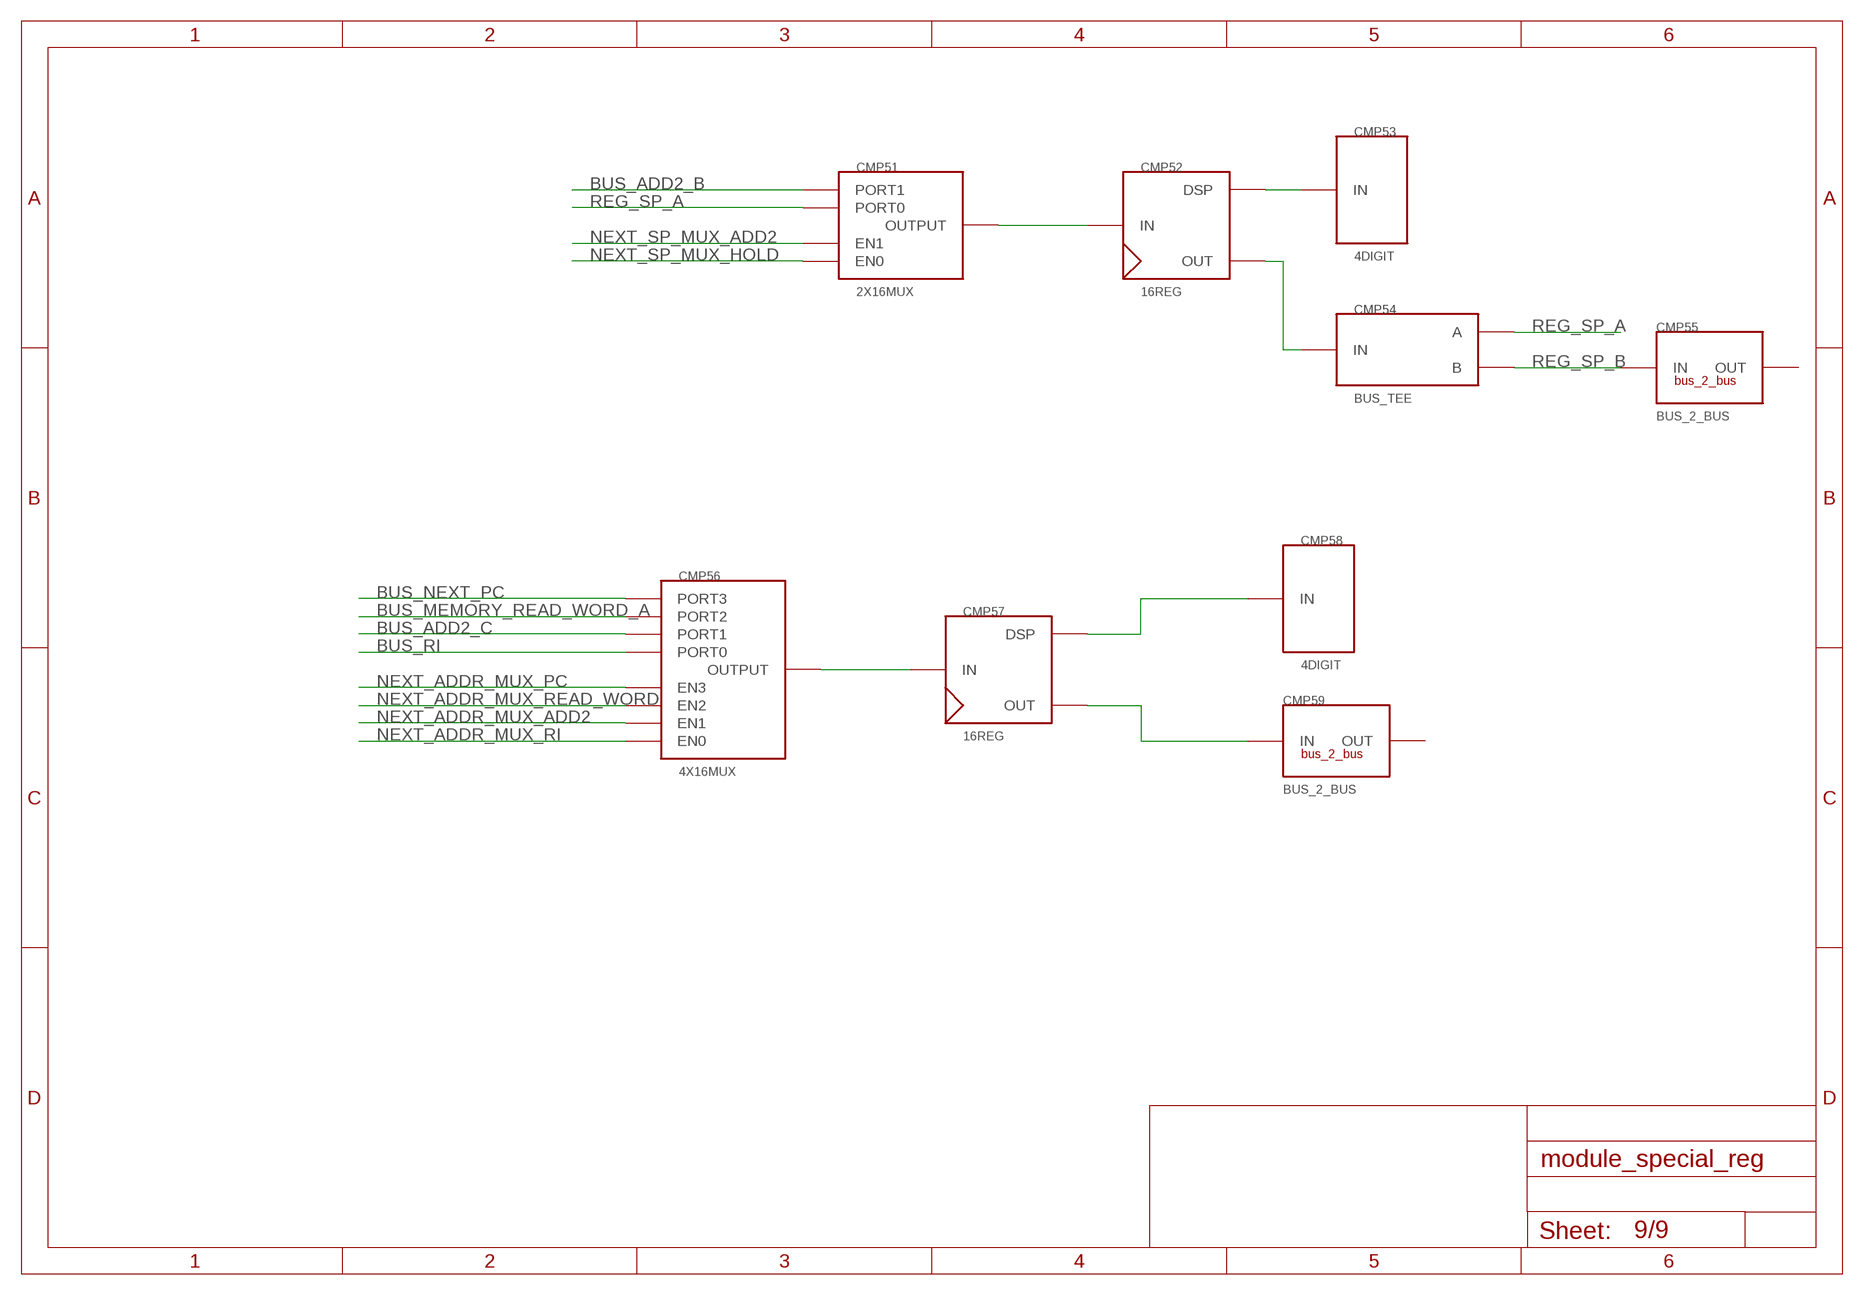
[diagram p8: schematic, sheet 9]

### Parts
CMP51  2X16MUX  [2X16MUX]
CMP52  16REG  [16REG]
CMP53  4DIGIT  [4DIGIT]
CMP54  BUS_TEE  [BUS_TEE]
CMP55  BUS_2_BUS  [BUS2BUS]
CMP56  4X16MUX  [4X16MUX]
CMP57  16REG  [16REG]
CMP58  4DIGIT  [4DIGIT]
CMP59  BUS_2_BUS  [BUS2BUS]

### Nets
BUS_ADD2_B: CMP51.PORT1 ; also sheet 3
BUS_ADD2_C: CMP56.PORT1 ; also sheet 3
BUS_MEMORY_READ_WORD_A: CMP56.PORT2 ; also sheet 3
BUS_NEXT_PC: CMP56.PORT3 ; also sheet 8
BUS_RI: CMP56.PORT0 ; also sheet 3
N$49: CMP51.OUT(OUTPUT) CMP52.INPUT(IN)
N$50: CMP52.DISPLAY(DSP) CMP53.P$1(IN)
N$51: CMP52.OUT CMP54.INPUT(IN)
N$52: CMP56.PORTOUT(OUTPUT) CMP57.INPUT(IN)
N$53: CMP57.DISPLAY(DSP) CMP58.P$1(IN)
N$54: CMP57.OUT CMP59.P$1(IN)
NEXT_ADDR_MUX_ADD2: CMP56.EN1 ; also sheet 1
NEXT_ADDR_MUX_PC: CMP56.EN3 ; also sheet 1
NEXT_ADDR_MUX_READ_WORD: CMP56.EN2 ; also sheet 1
NEXT_ADDR_MUX_RI: CMP56.EN0 ; also sheet 1
NEXT_SP_MUX_ADD2: CMP51.EN1 ; also sheet 1
NEXT_SP_MUX_HOLD: CMP51.EN0 ; also sheet 1
REG_SP_A: CMP51.PORT0 CMP54.OUT_A(A)
REG_SP_B: CMP54.OUTB(B) CMP55.P$1(IN)
Unconnected: CMP55.P$2(OUT) CMP59.P$2(OUT)

## Library data of the parts
CMP1 CMP2 CMP13 CMP35 CMP56 = modules:4X16MUX
CMP3 CMP5 CMP23 CMP25 CMP26 CMP32 CMP42 CMP48 CMP55 CMP59 = modules:BUS_2_BUS
CMP4 CMP30 CMP50 = modules:BUS_CONSTRUCT
CMP6 = modules:8BIT_ADD_SUB
CMP7 = modules:3X2DIGIT
CMP8 = modules:WORD_BYTE
CMP9 CMP14 CMP17 CMP19 CMP21 CMP22 CMP24 = modules:BUS_SPLIT_DISPLAY
CMP10 CMP11 CMP15 CMP34 = modules:BUS_4TEE
CMP12 CMP51 = modules:2X16MUX
CMP16 CMP33 CMP45 CMP54 = modules:BUS_TEE
CMP18 CMP39 CMP43 CMP53 CMP58 = modules:4DIGIT
CMP20 CMP38 CMP41 CMP52 CMP57 = modules:16REG
CMP27-CMP29 = modules:BUS_CONSTRUCT_DISPLAY
CMP31 = modules:2AND
U$1 = modules:BYTE_WORD

## Board
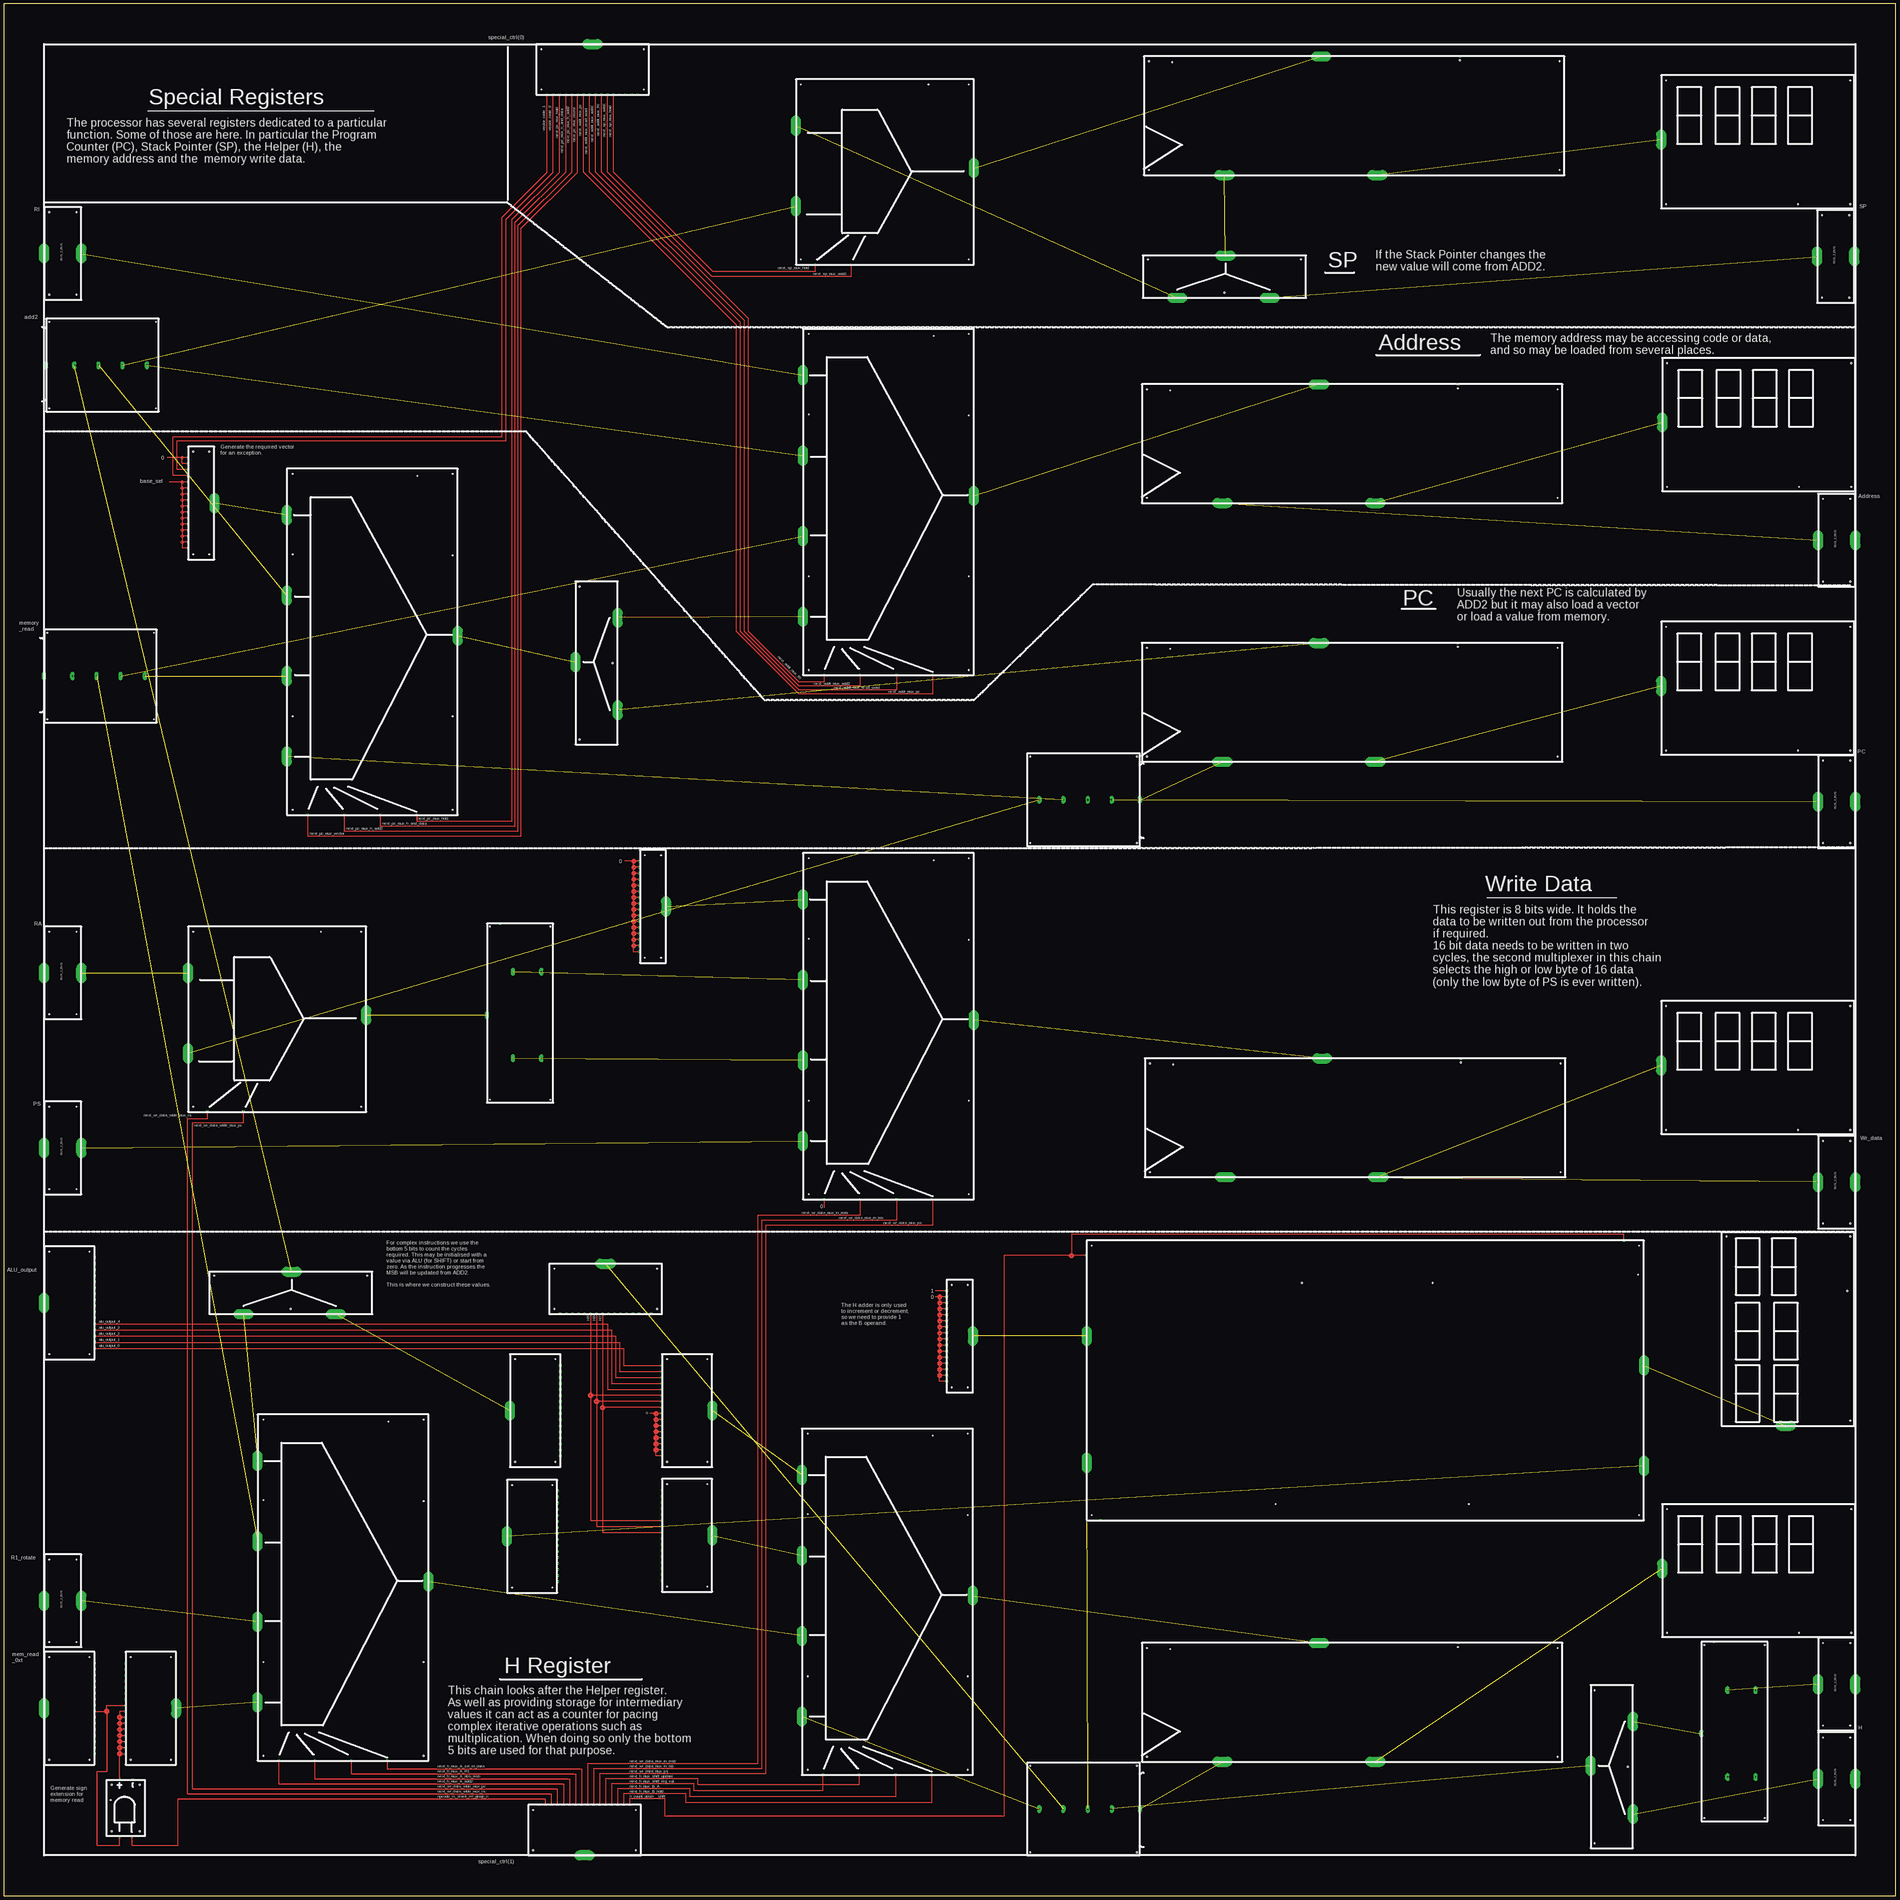
[diagram p9: board, top side]
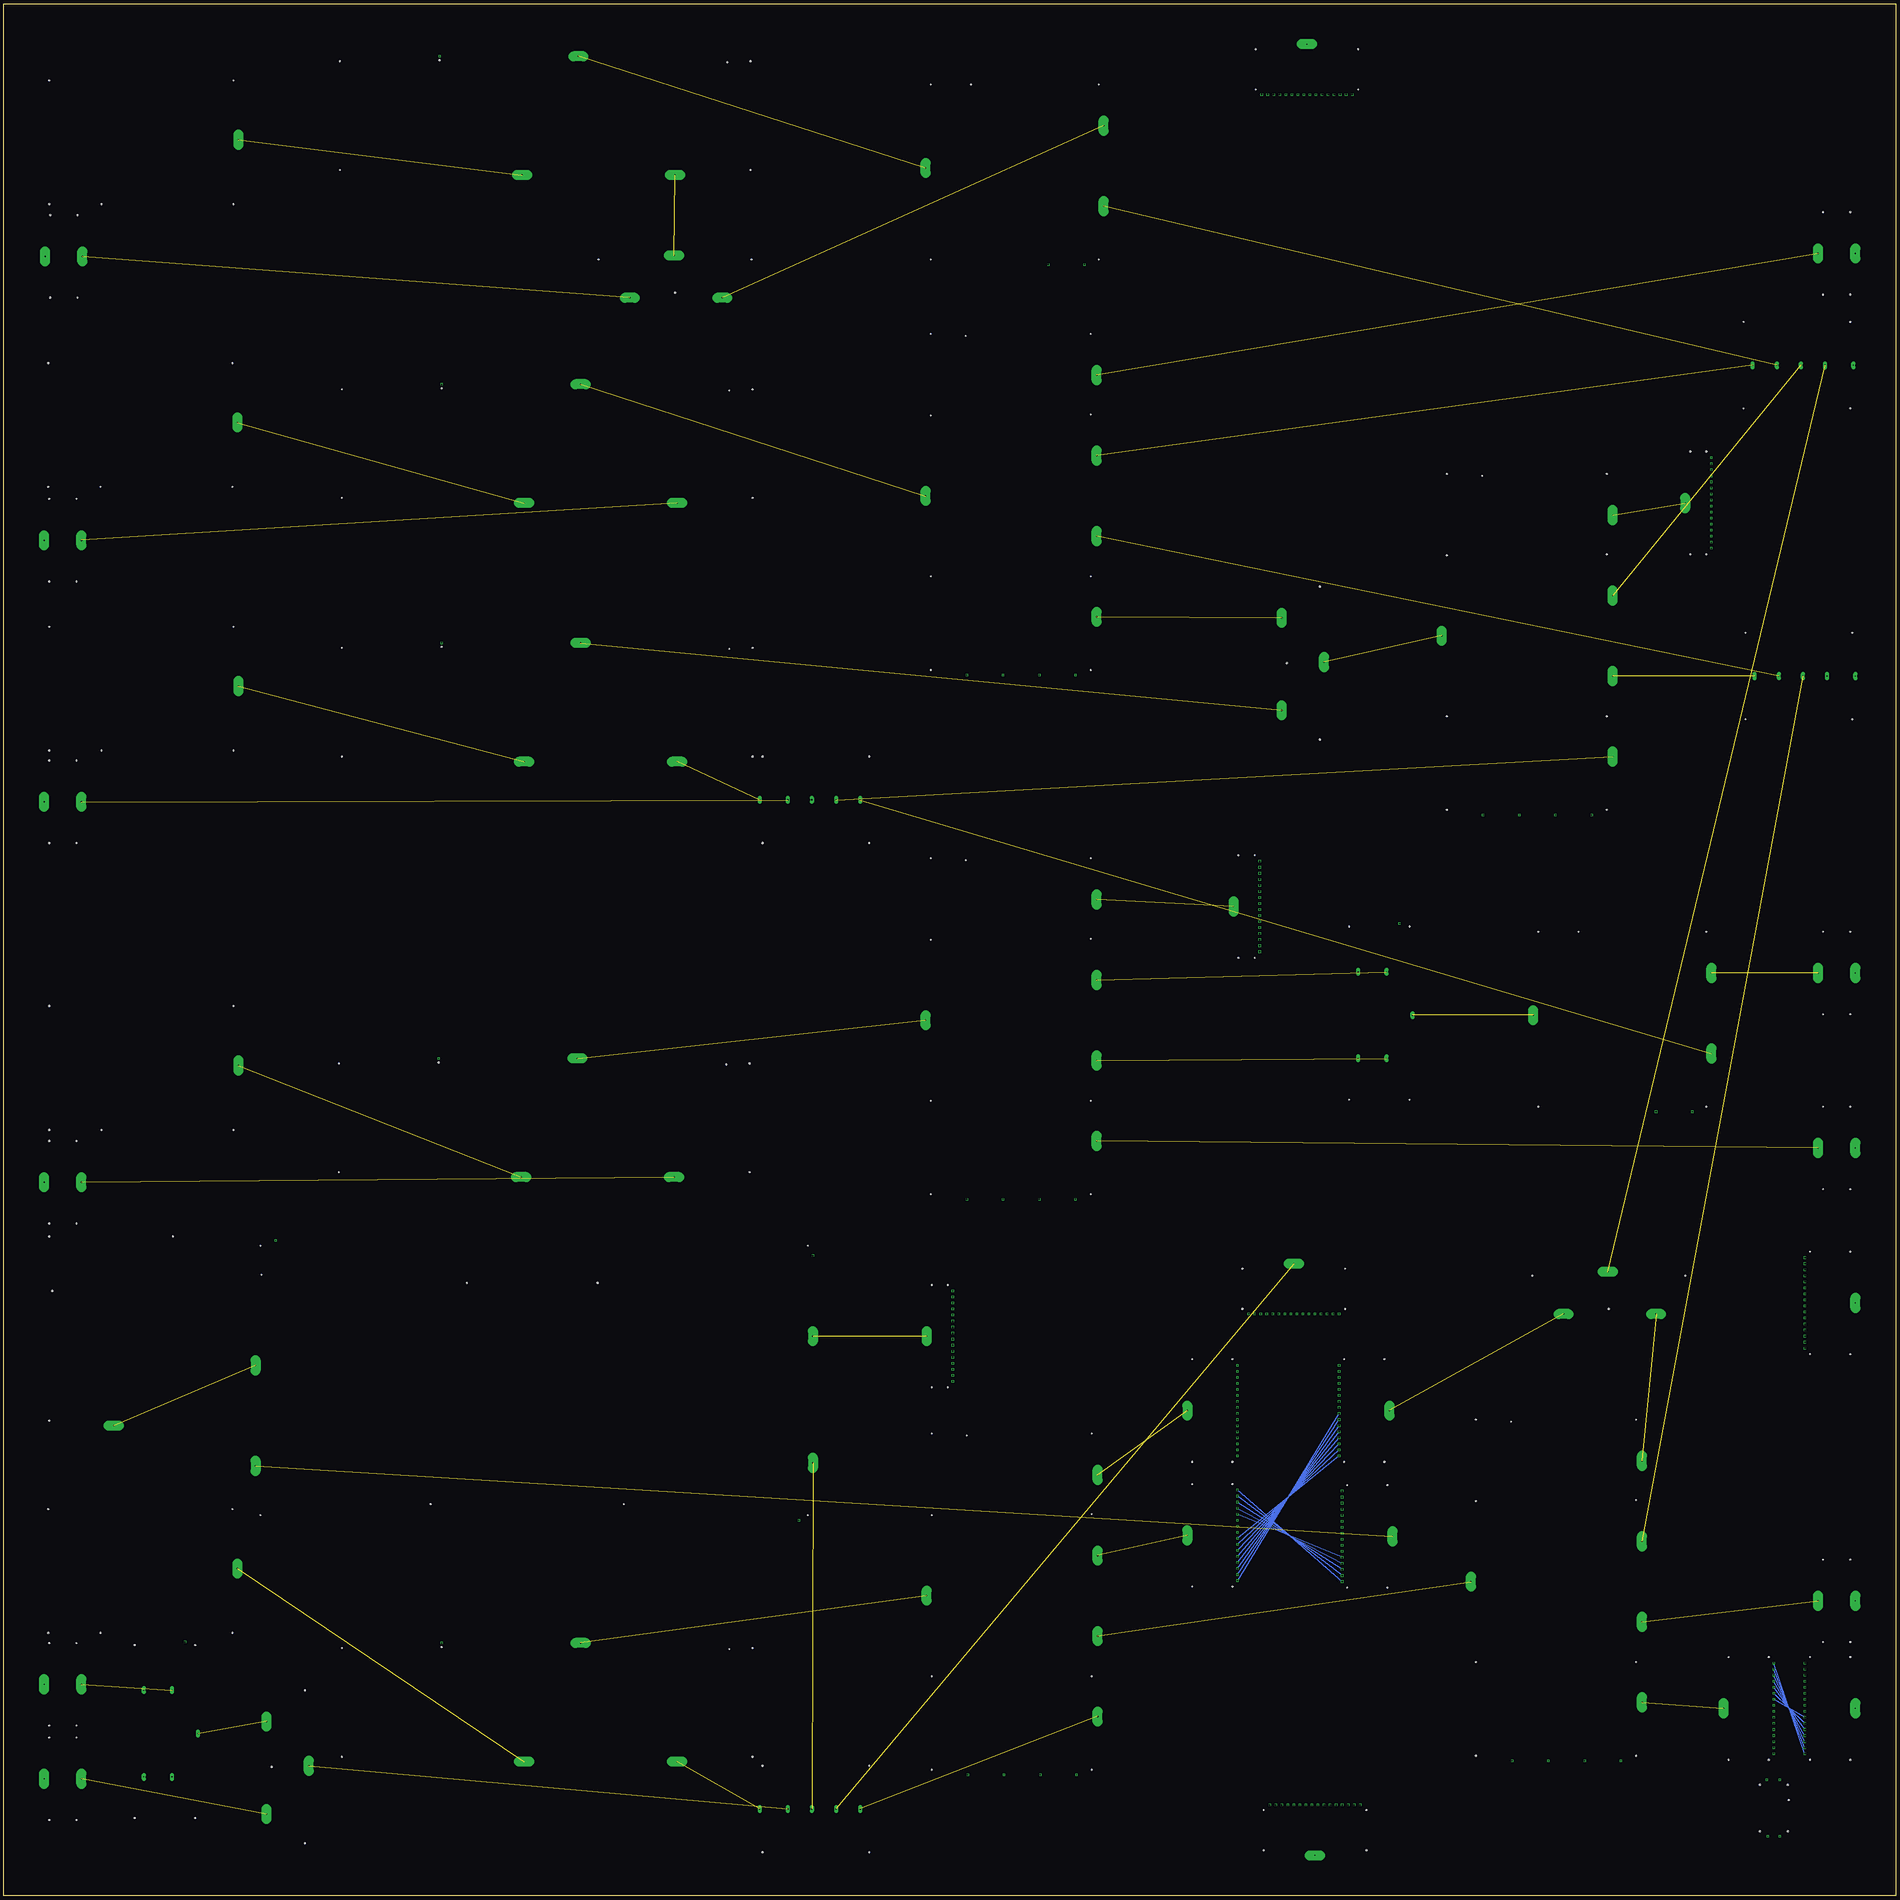
[diagram p10: board, bottom side, seen from below]

Size 1193.8 x 1193.8 mm. Coordinates in mm from the lower left corner, seen from the top.
Outline: 0,0 1193.8,0 1193.8,1193.8 0,1193.8 0,0
Copper layers (1*16): Top 0.035mm / dielectric 1.5mm / Bottom 0.035mm
Design rules "default": minimum track width 10mil, minimum drill 24mil, track to track 8mil, track to pad 8mil, pad to pad 8mil, via to via 8mil, smd to smd 8mil, copper to edge 40mil, drill to drill 8mil, minimum pad ring 10mil, minimum via ring 8mil, stop-mask expansion 4mil, vias tented up to drill 0mil, thermal gap 10mil
tKeepout: area 600.5,1159.3 to 618.7,1177.5; area 16.3,16.3 to 34.5,34.5; area 16.3,1159.3 to 34.5,1177.5; area 1159.3,1159.3 to 1177.5,1177.5; area 1159.3,16.3 to 1177.5,34.5; area 600.5,16.3 to 618.7,34.5

### Footprints (pad centres in the part's own frame; a part is rotated, then mirrored left to right if it is on the bottom)
4X16MUX = drill 0.8 square: EN0 -113.03,38.735; EN1 -113.03,15.875; EN2 -113.03,-6.985; EN3 -113.03,-29.845 | drill 0.8 pad 6.452 long: PORT0 76.2,52.07; PORT1 25.4,52.07; PORT2 -25.4,52.07; PORT3 -76.2,52.07; PORTOUT 0,-55.88 | hole 0.6: -109.855,-52.705; -50.8,-52.705; 50.8,-52.705; 102.235,-52.705; 102.235,48.26; 51.435,48.26; -50.8,48.26; -109.855,48.26; 100.965,-30.48
BUS2BUS = drill 0.8 pad 6.452 long: P$1 -1.27,12.7; P$2 -1.27,-10.795 | hole 0.6: -27.305,-7.62; -27.305,9.525; 24.765,9.525; 24.765,-7.62
BUS_SPLIT = drill 0.8 pad 6.452 long: INPUT -0.635,7.62 | drill 0.8 square: P$1 -29.21,-8.89; P$2 -25.4,-8.89; P$3 -21.59,-8.89; P$4 -17.78,-8.89; P$5 -13.97,-8.89; P$6 -10.16,-8.89; P$7 -6.35,-8.89; P$8 -2.54,-8.89; P$9 1.27,-8.89; P$10 5.08,-8.89; P$11 8.89,-8.89; P$12 12.7,-8.89; P$13 16.51,-8.89; P$14 20.32,-8.89; P$15 24.13,-8.89; P$16 27.94,-8.89 | hole 0.6: -33.02,-5.715; -33.02,4.445; 31.75,4.445; 31.75,-5.715
8BIT_ADD_SUB = drill 0.8 pad 6.452 long: A 48.895,-181.61; B -31.115,-181.61; DISP -12.7,170.18; R 50.8,170.18 | drill 0.8 square: C_IN -91.44,157.48; C_OUT 85.09,-172.72; INV_B -81.915,-181.61 | hole 0.6: -88.265,-178.435; 81.915,-178.435; 81.915,167.005; -88.265,167.005; 74.93,59.69; -64.77,36.83; -64.77,-45.72; 74.93,-62.23; -69.85,166.37
3X2DIGIT = drill 0.8 pad 6.452 long: P$1 -0.635,-60.96 | hole 0.6: 38.1,24.13; 40.005,-57.785; 40.005,58.42; -38.1,58.42
WORD_BYTE = drill 0.8 pad 2.54 long: LSB_1 -29.21,3.81; LSB_2 -29.21,-13.97; MSB_1 25.4,3.81; MSB_2 25.4,-13.97; SRC -1.905,20.32 | drill 0.8 square: MS_BIT 55.88,12.065 | hole 0.6: -55.245,-19.685; -55.245,18.415; 53.975,18.415; 53.975,-19.685
BUS_SPLIT_DISPLAY = drill 0.8 pad 6.452 long: INPUT 0,15.24 | drill 0.8 square: P$1 -28.575,-16.51; P$2 -24.765,-16.51; P$3 -20.955,-16.51; P$4 -17.145,-16.51; P$5 -13.335,-16.51; P$6 -9.525,-16.51; P$7 -5.715,-16.51; P$8 -1.905,-16.51; P$9 1.905,-16.51; P$10 5.715,-16.51; P$11 9.525,-16.51; P$12 13.335,-16.51; P$13 17.145,-16.51; P$14 20.955,-16.51; P$15 24.765,-16.51; P$16 28.575,-16.51 | hole 0.6: -32.385,-13.335; -32.385,12.065; 32.385,12.065; 32.385,-13.335
BUS_4TEE = drill 0.8 pad 2.54 long: 1 2.54,12.7; 2 2.54,-2.54; 3 2.54,-17.78; 4 2.54,-33.02; SRC 2.54,30.48 | hole 0.6: -24.765,28.575; 29.845,28.575; 29.845,-38.735; -24.765,-38.735
2X16MUX = drill 0.8 square: EN0 -57.15,38.1; EN1 -57.15,15.24 | drill 0.8 pad 6.452 long: OUT 3.81,-62.23; PORT0 30.48,50.165; PORT1 -20.32,50.165 | hole 0.6: 56.515,46.99; -53.975,46.99; -53.975,-59.055; 56.515,-59.055; 56.515,-33.655
BUS_TEE = drill 0.8 pad 6.452 long: INPUT 0,15.24; OUT_A -30.48,-11.43; OUTB 27.94,-11.43 | hole 0.6: -48.895,12.7; -0.635,-8.255; 47.625,12.7
4DIGIT = drill 0.8 pad 6.452 long: P$1 -57.15,1.27 | hole 0.6: 29.21,-39.37; 62.23,-39.37; 62.23,38.735; -53.975,38.735; -53.975,-39.37
16REG = drill 0.8 pad 6.452 long: DISPLAY 17.78,-33.02; INPUT -17.78,41.91; OUT -78.74,-33.02 | drill 0.8 square: P$1 69.85,41.91 | hole 0.6: -126.365,-29.845; -126.365,38.735; 132.715,38.735; 132.715,-29.845; -111.76,38.1; 69.85,39.37
2AND = drill 0.8 square: OUT_M 19.05,-4.445; OUT_P 19.05,3.81; P$1 -16.51,-3.81; P$2 -16.51,3.81 | hole 0.6: -13.335,8.89; 15.875,-8.89; -13.335,-8.89; 15.875,8.89; 6.35,9.525

### Placement (x,y rotation side)
CMP1  212.09,198.12 90 top
CMP2  555.62,189.23 90 top
CMP3  1157.61,74.93 90 top
CMP4  603.88,352.43 270 top
CMP5  38.1,187.32 90 top
CMP6  864.87,321.94 270 top
CMP7  1125.22,357.5 0 top
CMP8  325.12,557.53 90 top
CMP9  366.39,40.64 180 top
CMP10  57.15,963.29 90 top
CMP11  55.88,767.08 90 top
CMP12  166.37,551.82 90 top
CMP13  556.26,552.45 90 top
CMP14  371.48,1153.16 0 top
CMP15  686.43,694.05 270 top
CMP16  181.61,378.46 0 top
CMP17  334.64,306.07 90 top
CMP18  1102.99,522.61 0 top
CMP19  379.73,383.54 0 top
CMP20  849.63,486.41 0 top
CMP21  40.64,118.11 90 top
CMP22  332.74,226.69 90 top
CMP23  1157.61,451.49 90 top
CMP24  40.64,374.01 90 top
CMP25  38.1,583.57 90 top
CMP26  38.1,473.07 90 top
CMP27  93.34,118.11 270 top
CMP28  431.8,306.07 270 top
CMP29  431.8,227.33 270 top
CMP30  410.21,623.57 270 top
CMP31  76.83,53.98 90 top
CMP32  1157.61,134.62 90 top
CMP33  1016.63,81.92 90 top
CMP34  686.43,57.15 270 top
CMP35  230.5,795.02 90 top
CMP38  847.73,748.66 0 top
CMP39  1102.99,762 0 top
CMP41  847.73,117.47 0 top
CMP42  1157.61,691.51 90 top
CMP43  1103.63,205.1 0 top
CMP45  375.92,778.51 90 top
CMP48  38.1,1037.59 90 top
CMP50  125.09,878.21 270 top
CMP51  549.91,1086.48 90 top
CMP52  849,1118.87 0 top
CMP53  1102.99,1106.81 0 top
CMP54  770.89,1019.81 0 top
CMP55  1156.97,1035.68 90 top
CMP56  556.26,883.28 90 top
CMP57  847.73,911.86 0 top
CMP58  1103.63,928.37 0 top
CMP59  1157.61,856.62 90 top
U$1  1091.57,104.14 90 top

### Tracks (layer width: path | path; a pad name or v marks a point on that pad's centre or on a via)
ADD2_0
  Bottom 0.305: CMP17.P$1 CMP29.P$9
ADD2_1
  Bottom 0.305: CMP17.P$2 CMP29.P$10
ADD2_2
  Bottom 0.305: CMP17.P$3 CMP29.P$11
ADD2_3
  Bottom 0.305: CMP17.P$4 CMP29.P$12
ADD2_4
  Bottom 0.305: CMP17.P$5 CMP29.P$13
ADD2_5
  Bottom 0.305: CMP17.P$6 CMP29.P$14
ADD2_6
  Bottom 0.305: CMP17.P$7 CMP29.P$15
ADD2_7
  Bottom 0.305: CMP17.P$8 CMP29.P$16
BUS_ADD2_A  (1 unrouted)
BUS_ADD2_B  (1 unrouted)
BUS_ADD2_C  (1 unrouted)
BUS_ADD2_D  (1 unrouted)
BUS_ALU_OUTPUT0
  Top 0.61: CMP24.P$1 391.16,345.44 391.16,334.64 CMP28.P$1
BUS_ALU_OUTPUT1
  Top 0.61: CMP24.P$2 388.62,349.25 388.62,330.83 CMP28.P$2
BUS_ALU_OUTPUT2
  Top 0.61: CMP24.P$3 386.08,353.06 386.08,327.02 CMP28.P$3
BUS_ALU_OUTPUT3
  Top 0.61: CMP24.P$4 383.54,356.87 383.54,323.21 CMP28.P$4
BUS_ALU_OUTPUT4
  Top 0.61: CMP24.P$5 381,360.68 381,319.4 CMP28.P$5
BUS_H_A  (1 unrouted)
BUS_H_ADDER  (1 unrouted)
BUS_H_B  (1 unrouted)
BUS_H_C  (1 unrouted)
BUS_H_D  (1 unrouted)
BUS_MEMORY_READ_WORD_A  (1 unrouted)
BUS_MEMORY_READ_WORD_B  (1 unrouted)
BUS_MEMORY_READ_WORD_C  (1 unrouted)
BUS_NEXT_PC  (1 unrouted)
BUS_PC_A  (1 unrouted)
BUS_PC_B  (1 unrouted)
BUS_PS  (1 unrouted)
BUS_RA  (1 unrouted)
BUS_RI  (1 unrouted)
DISP_CONN  (1 unrouted)
H_5
  Top 0.61: CMP19.P$6 370.2,315.6 | 370.2,315.6 370.2,236.85 CMP29.P$6 | CMP28.P$6 370.2,315.6
H_6
  Top 0.61: CMP19.P$7 374.01,311.79 | 374.01,311.79 374.01,233.04 CMP29.P$7 | CMP28.P$7 374.01,311.79
H_7
  Top 0.61: CMP19.P$8 377.82,307.98 | 377.82,307.98 377.82,229.24 CMP29.P$8 | CMP28.P$8 377.82,307.98
H_ADDER0
  Bottom 0.305: CMP29.P$1 CMP22.P$1
H_ADDER1
  Bottom 0.305: CMP22.P$2 CMP29.P$2
H_ADDER2
  Bottom 0.305: CMP22.P$3 CMP29.P$3
H_ADDER3
  Bottom 0.305: CMP29.P$4 CMP22.P$4
H_ADDER4
  Bottom 0.305: CMP22.P$5 CMP29.P$5
H_COUNT_DOWN__SHIFT
  Top 0.61: CMP6.C_IN 1022.35,417.19 673.74,417.19 673.74,403.86 | 673.74,403.86 631.19,403.86 631.19,50.16 417.19,50.16 417.19,60.96 394.97,60.96 CMP9.P$1 | CMP6.INV_B 673.74,403.86
H_MSB  (1 unrouted)
H_OUT  (1 unrouted)
H_SHIFT_UPDATE_DATA  (1 unrouted)
N$1  (1 unrouted)
N$2  (1 unrouted)
N$3  (1 unrouted)
N$5
  Top 0.61: CMP4.P$2 590.55,377.82 | 590.55,377.82 588.01,377.82 | CMP4.P$16 590.55,324.49 590.55,328.3 | 590.55,328.3 590.55,332.11 | 590.55,332.11 590.55,335.92 | 590.55,335.92 590.55,339.73 | 590.55,339.73 590.55,343.54 | 590.55,343.54 590.55,347.35 | 590.55,347.35 590.55,351.15 | 590.55,351.15 590.55,354.96 | 590.55,354.96 590.55,358.77 | 590.55,358.77 590.55,362.58 | 590.55,362.58 590.55,366.39 | 590.55,366.39 590.55,370.2 | 590.55,370.2 590.55,374.01 | 590.55,374.01 590.55,377.82 | CMP4.P$4 590.55,370.2 | CMP4.P$3 590.55,374.01 | CMP4.P$5 590.55,366.39 | CMP4.P$6 590.55,362.58 | CMP4.P$7 590.55,358.77 | CMP4.P$8 590.55,354.96 | CMP4.P$9 590.55,351.15 | CMP4.P$10 590.55,347.35 | CMP4.P$11 590.55,343.54 | CMP4.P$12 590.55,339.73 | CMP4.P$13 590.55,335.92 | CMP4.P$14 590.55,332.11 | CMP4.P$15 590.55,328.3
N$6  (1 unrouted)
N$7  (1 unrouted)
N$8
  Top 0.61: CMP28.P$16 411.48,277.5 411.48,281.31 | 411.48,281.31 411.48,285.12 | 411.48,285.12 411.48,288.93 | 411.48,288.93 411.48,292.74 | 411.48,292.74 411.48,296.55 | 411.48,296.55 411.48,300.36 | 411.48,300.36 411.48,304.17 | 411.48,304.17 407.67,304.17 | CMP28.P$9 411.48,304.17 | CMP28.P$10 411.48,300.36 | CMP28.P$11 411.48,296.55 | CMP28.P$12 411.48,292.74 | CMP28.P$13 411.48,288.93 | CMP28.P$15 411.48,281.31 | CMP28.P$14 411.48,285.12
N$9  (1 unrouted)
N$10  (1 unrouted)
N$12
  Top 0.61: CMP50.P$2 112.39,903.61 112.39,907.41 | 112.39,907.41 102.87,907.41 | CMP50.P$1 112.39,907.41
N$13
  Top 0.61: 594.36,381.63 588.01,381.63
N$14
  Top 0.61: 517.52,438.15 517.52,434.34
N$15  (1 unrouted)
N$16
  Top 0.61: CMP30.P$1 397.51,652.78 | 397.51,652.78 391.8,652.78 | CMP30.P$16 397.51,595.63 397.51,599.44 | 397.51,599.44 397.51,603.25 | 397.51,603.25 397.51,607.06 | 397.51,607.06 397.51,610.87 | 397.51,610.87 397.51,614.68 | 397.51,614.68 397.51,618.49 | 397.51,618.49 397.51,622.3 | 397.51,622.3 397.51,626.11 | 397.51,626.11 397.51,629.92 | 397.51,629.92 397.51,633.73 | 397.51,633.73 397.51,637.54 | 397.51,637.54 397.51,641.35 | 397.51,641.35 397.51,645.16 | 397.51,645.16 397.51,648.97 | 397.51,648.97 397.51,652.78 | CMP30.P$2 397.51,648.97 | CMP30.P$3 397.51,645.16 | CMP30.P$4 397.51,641.35 | CMP30.P$5 397.51,637.54 | CMP30.P$6 397.51,633.73 | CMP30.P$7 397.51,629.92 | CMP30.P$8 397.51,626.11 | CMP30.P$9 397.51,622.3 | CMP30.P$10 397.51,618.49 | CMP30.P$11 397.51,614.68 | CMP30.P$12 397.51,610.87 | CMP30.P$13 397.51,607.06 | CMP30.P$14 397.51,603.25 | CMP30.P$15 397.51,599.44
N$19  (1 unrouted)
N$33  (1 unrouted)
N$34  (1 unrouted)
N$35  (1 unrouted)
N$38  (1 unrouted)
N$42  (1 unrouted)
N$43  (1 unrouted)
N$44  (1 unrouted)
N$46  (1 unrouted)
N$48
  Top 0.61: 112.39,888.37 112.39,884.55 | 112.39,884.55 112.39,880.75 | 112.39,880.75 112.39,876.93 | 112.39,876.93 112.39,873.12 | 112.39,873.12 112.39,869.32 | 112.39,869.32 112.39,865.5 | 112.39,865.5 112.39,861.7 | 112.39,861.7 112.39,857.88 | 112.39,857.88 112.39,854.08 | 112.39,854.08 112.39,850.26 CMP50.P$16 | CMP50.P$15 112.39,854.08 | CMP50.P$14 112.39,857.88 | CMP50.P$13 112.39,861.7 | CMP50.P$12 112.39,865.5 | CMP50.P$11 112.39,869.32 | CMP50.P$10 112.39,873.12 | CMP50.P$9 112.39,876.93 | CMP50.P$8 112.39,880.75 | CMP50.P$7 112.39,884.55 | CMP50.P$6 112.39,888.37 | 112.39,888.37 112.39,892.17 | 112.39,892.17 104.14,892.17 | CMP50.P$5 112.39,892.17
N$49  (1 unrouted)
N$50  (1 unrouted)
N$51  (1 unrouted)
N$52  (1 unrouted)
N$53  (1 unrouted)
N$54  (1 unrouted)
NEXT_ADDR_MUX_ADD2
  Top 0.61: CMP56.EN1 540.38,763.27 501.65,763.27 467.36,797.56 467.36,993.77 373.38,1087.76 CMP14.P$9
NEXT_ADDR_MUX_PC
  Top 0.61: CMP56.EN3 586.11,758.19 501.65,758.19 462.28,797.56 462.28,991.24 365.76,1087.76 CMP14.P$7
NEXT_ADDR_MUX_READ_WORD
  Top 0.61: CMP56.EN2 563.25,760.73 501.65,760.73 464.82,797.56 464.82,992.5 369.57,1087.76 CMP14.P$8
NEXT_ADDR_MUX_RI
  Top 0.61: CMP56.EN0 517.52,765.81 501.65,765.81 469.9,797.56 469.9,995.04 377.19,1087.76 CMP14.P$10
NEXT_H_MUX  (1 unrouted)
NEXT_H_MUX_A  (1 unrouted)
NEXT_H_MUX_A_ABS_MSB
  Top 0.61: CMP1.EN1 196.22,73.66 356.87,73.66 CMP9.P$11
NEXT_H_MUX_A_ADD2
  Top 0.61: CMP1.EN0 173.35,70.48 353.06,70.48 CMP9.P$12
NEXT_H_MUX_A_R1
  Top 0.61: CMP1.EN2 219.07,76.83 360.68,76.83 CMP9.P$10
NEXT_H_MUX_A_SXT_RD_DATA
  Top 0.61: CMP1.EN3 241.94,80.01 364.49,80.01 CMP9.P$9
NEXT_H_MUX_B_A
  Top 0.61: CMP2.EN2 562.61,62.23 433.07,62.23 433.07,67.31 387.35,67.31 CMP9.P$3
NEXT_H_MUX_B_HOLD
  Top 0.61: CMP2.EN3 585.47,58.42 430.53,58.42 430.53,64.14 391.16,64.14 CMP9.P$2
NEXT_H_MUX_B_SHIFT_REG_VAL
  Top 0.61: CMP9.P$4 383.54,70.48 435.61,70.48 435.61,66.04 516.89,66.04 CMP2.EN0
NEXT_H_MUX_B_SHIFT_UPDATE
  Top 0.61: CMP9.P$5 379.73,73.66 438.15,73.66 438.15,69.85 539.75,69.85 CMP2.EN1
NEXT_PC_MUX_ADD2
  Top 0.61: CMP35.EN1 214.63,671.83 324.49,671.83 324.49,1054.1 358.14,1087.76 CMP14.P$5
NEXT_PC_MUX_H_AND_DATA
  Top 0.61: CMP35.EN2 237.49,675 322.58,675 322.58,1056.01 354.33,1087.76 CMP14.P$4
NEXT_PC_MUX_HOLD
  Top 0.61: CMP35.EN3 260.35,678.18 320.68,678.18 320.68,1057.91 350.52,1087.76 CMP14.P$3
NEXT_SP_MUX_ADD2
  Top 0.61: CMP51.EN1 534.67,1021.72 447.04,1021.72 381,1087.76 CMP14.P$11
NEXT_SP_MUX_HOLD
  Top 0.61: CMP51.EN0 511.81,1024.89 447.68,1024.89 384.81,1087.76 CMP14.P$12
NEXT_WR_DATA_MUX_PC_RA_LSB
  Top 0.61: CMP13.EN2 563.25,426.08 478.15,426.08 478.15,80.01 372.11,80.01 CMP9.P$7
NEXT_WR_DATA_MUX_PC_RA_MSB
  Top 0.61: CMP13.EN1 540.38,429.26 475.62,429.26 475.62,83.19 368.3,83.19 CMP9.P$8
NEXT_WR_DATA_MUX_PS
  Top 0.61: CMP13.EN3 586.11,422.91 480.69,422.91 480.69,76.83 375.92,76.83 CMP9.P$6
NEXT_WR_DATA_WIDE_MUX_PC
  Top 0.61: CMP12.EN1 151.13,487.68 118.75,487.68 118.75,67.31 349.25,67.31 CMP9.P$13
NEXT_WR_DATA_WIDE_MUX_RA
  Top 0.61: CMP12.EN0 128.27,490.22 115.57,490.22 115.57,64.14 345.44,64.14 CMP9.P$14
OPCODE_IS_STACK_REL_GROUP_N
  Top 0.61: CMP31.P$1 80.64,31.75 109.86,31.75 109.86,60.96 341.63,60.96 CMP9.P$15
REG_H  (1 unrouted)
REG_R1_ROTATE  (1 unrouted)
REG_SP_A  (1 unrouted)
REG_SP_B  (1 unrouted)
SHIFT_REG_VALUE  (1 unrouted)
SIGN_EXTEND_READ_DATA  (1 unrouted)
SIGN_EXTEND_VAL
  Top 0.61: CMP27.P$9 73.03,116.2 73.03,112.39 | 73.03,112.39 73.03,108.58 | 73.03,108.58 73.03,104.78 | 73.03,104.78 73.03,100.97 | 73.03,100.97 73.03,97.16 | 73.03,97.16 73.03,93.34 | 73.03,93.34 73.03,89.53 | 73.03,89.53 CMP27.P$16 | CMP27.P$15 73.03,93.34 | CMP27.P$14 73.03,97.16 | CMP27.P$13 73.03,100.97 | CMP27.P$12 73.03,104.78 | CMP27.P$11 73.03,108.58 | CMP27.P$10 73.03,112.39 | CMP31.OUT_P 73.03,89.53
TRAP_STATE_7
  Top 0.61: CMP35.EN0 191.77,668.65 326.39,668.65 326.39,1052.19 361.95,1087.76 CMP14.P$6
VECTOR_CODE_0
  Top 0.61: CMP50.P$3 109.22,899.79 109.22,918.21 316.87,918.21 316.87,1057.91 346.71,1087.76 CMP14.P$2
VECTOR_CODE_1
  Top 0.61: CMP50.P$4 106.68,895.99 106.68,920.75 314.32,920.75 314.32,1059.18 342.9,1087.76 CMP14.P$1
VECTOR_VALUE  (1 unrouted)
ZXT_READ_DATA_0
  Bottom 0.254: CMP21.P$1 CMP27.P$1
ZXT_READ_DATA_1
  Bottom 0.254: CMP21.P$2 CMP27.P$2
ZXT_READ_DATA_2
  Bottom 0.254: CMP21.P$3 CMP27.P$3
ZXT_READ_DATA_3
  Bottom 0.254: CMP21.P$4 CMP27.P$4
ZXT_READ_DATA_4
  Bottom 0.254: CMP21.P$5 CMP27.P$5
ZXT_READ_DATA_5
  Bottom 0.254: CMP21.P$6 CMP27.P$6
ZXT_READ_DATA_6
  Bottom 0.254: CMP21.P$7 CMP27.P$7
ZXT_READ_DATA_7
  Top 0.61: CMP21.P$8 64.77,116.2 | 64.77,116.2 64.77,78.11 58.42,78.11 58.42,31.75 73.03,31.75 CMP31.P$2 | 64.77,116.2 64.77,120.02 CMP27.P$8
(copper drawn outside any net)
  shapes: Top circle x60

### Text on the board
tPlace: special_ctrl(0) | Special Registers | vector_code_1 | vector_code_0 | next_addr_mux_pc | next_addr_mux_RI | next_sp_mux_add2 | next_sp_mux_hold | next_pc_mux_hold | next_pc_mux_vector | next_addr_mux_add2 | next_pc_mux_h_add2 | next_pc_mux_h_and_data | next_addr_mux_read_word | The processor has several registers dedicated to a particular / function. Some of those are here. In particular the Program / Counter (PC), Stack Pointer (SP), the Helper (H), the / memory address and the memory write data. | SP | RI | next_sp_mux_hold | SP | If the Stack Pointer changes the / new value will come from ADD2. | next_sp_mux_add2 | add2 | Address | The memory address may be accessing code or data, / and so may be loaded from several places. | Generate the required vector / for an exception. | 0 | base_sel | Address | PC | Usually the next PC is calculated by / ADD2 but it may also load a vector / or load a value from memory. | memory / _read | next_addr_mux_RI | next_addr_mux_add2 | next_addr_mux_read_word | next_addr_mux_pc | PC | next_pc_mux_hold | next_pc_mux_h_and_data | next_pc_mux_h_add2 | next_pc_mux_vector | 0 | Write Data | RA | This register is 8 bits wide. It holds the / data to be written out from the processor / if required. / 16 bit data needs to be written in two / cycles, the second multiplexer in this chain / selects the high or low byte of 16 data / (only the low byte of PS is ever written). | PS | next_wr_data_wide_mux_ra | next_wr_data_wide_mux_pc | Wr_data | 0 | next_wr_data_mux_rn_msb | next_wr_data_mux_rn_lsb | next_wr_data_mux_ps | ALU_output | For complex instructions we use the / bottom 5 bits to count the cycles / required. This may be initialised with a / value via ALU (for SHIFT) or start from / zero. As the instruction progresses the / MSB will be updated from ADD2. / / This is where we construct these values. | 1 | 0 | H5 | H6 | H7 | alu_output_4 | The H adder is only used / to increment or decrement, / so we need to provide 1 / as the B operand. | alu_output_3 | alu_output_2 | alu_output_1 | alu_output_0 | 0 | R1_rotate | mem_read / _0xt | H Register | H | This chain looks after the Helper register. / As well as providing storage for intermediary / values it can act as a counter for pacing / complex iterative operations such as / multiplication. When doing so only the bottom / 5 bits are used for that purpose. | next_wr_data_mux_rn_msb | next_h_mux_A_sxt_rd_data | next_wr_data_mux_rn_lsb | next_h_mux_A_R1 | next_wr_data_mux_ps | next_h_mux_A_abs_msb | next_h_mux_shift_update | next_h_mux_A_add2 | next_h_mux_shift_reg_val | next_wr_data_wide_mux_pc | next_h_mux_B_A | next_wr_data_wide_mux_ra | next_h_mux_B_hold | opcode_is_stack_rel_group_n | h_count_down__shift | Generate sign / extension for / memory read | special_ctrl(1)